# Altium project project.PrjPcb (part 1 of 2)
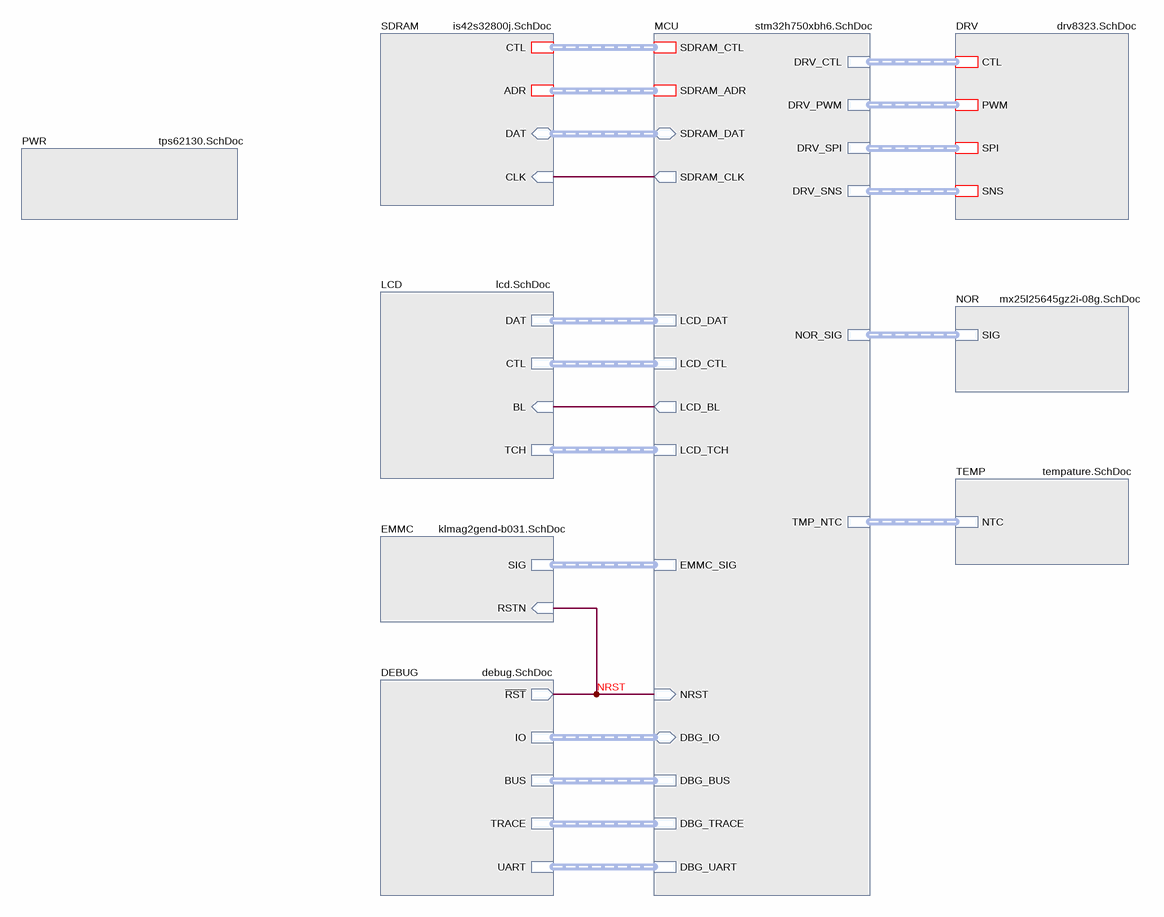
[diagram p0: top.SchDoc]
12 sheets, 396 parts. Net scope: hierarchical (ports join the sheet entries above them; power ports are global).
Board file: miaow_foc_board.PcbDoc
Sheets:
  top.SchDoc
    DRV = drv8323.SchDoc
    SDRAM = is42s32800j.SchDoc
    PWR = tps62130.SchDoc
    MCU = stm32h750xbh6.SchDoc
      MCU_PWR = stm32h750xbh6-pwr.SchDoc
      MCU_SIG = stm32h750xbh6-sig.SchDoc
    LCD = lcd.SchDoc
    EMMC = klmag2gend-b031.SchDoc
    NOR = mx25l25645gz2i-08g.SchDoc
    DEBUG = debug.SchDoc
    TEMP = tempature.SchDoc

## Sheet top.SchDoc: TOP
size A4; Date: 10.02.2025; CheckedBy: BCY; DrawnBy: miaow; DocumentNumber: 1; Revision: v0.0.1; SheetNumber: 1; SheetTotal: 12; Sample: A0; Url: github.com/miaow-cn/pcb-lib; Liscense: GPLv3; Board: MIAOW FOC BOARD; BoardType: MAIN_PCB; Desc: top overview

### Sub-sheets
DEBUG = debug.SchDoc: BUS (harness DBG_BUS), ~{RST} (out), TRACE (harness DBG_TRACE), UART (harness DBG_UART), IO (harness DBG_IO)
DRV = drv8323.SchDoc: CTL (harness DRV_CTL), SNS (harness DRV_SNS), SPI (harness DRV_SPI), PWM (harness DRV_PWM)
EMMC = klmag2gend-b031.SchDoc: SIG (harness EMMC_SIG), RSTN (in)
LCD = lcd.SchDoc: DAT (harness LCD_DAT), CTL (harness LCD_CTL), BL (in), TCH (harness LCD_TCH)
MCU = stm32h750xbh6.SchDoc: SDRAM_CLK (out), SDRAM_CTL (harness SDRAM_CTL), SDRAM_ADR (harness SDRAM_ADR), SDRAM_DAT (bidir, harness SDRAM_DAT), DRV_CTL (harness DRV_CTL), DRV_PWM (harness DRV_PWM), DRV_SPI (harness DRV_SPI), DRV_SNS (harness DRV_SNS), NRST (in), LCD_DAT (harness LCD_DAT), LCD_BL (out), LCD_TCH (harness LCD_TCH), EMMC_SIG (harness EMMC_SIG), NOR_SIG (harness NOR_SIG), LCD_CTL (harness LCD_CTL), DBG_TRACE (harness DBG_TRACE), DBG_UART (harness DBG_UART), DBG_BUS (harness DBG_BUS), DBG_IO (bidir, harness DBG_IO), TMP_NTC (harness TMP_NTC)
NOR = mx25l25645gz2i-08g.SchDoc: SIG (harness NOR_SIG)
PWR = tps62130.SchDoc: no entries
SDRAM = is42s32800j.SchDoc: ADR (harness SDRAM_ADR), CTL (harness SDRAM_CTL), CLK (in), DAT (bidir, harness SDRAM_DAT)
TEMP = tempature.SchDoc: NTC (harness TMP_NTC)

### Nets
BL: sheet MCU/LCD_BL, sheet LCD/BL
NRST: sheet MCU/NRST, sheet EMMC/RSTN, sheet DEBUG/~{RST}
SDRAM_CLK: sheet SDRAM/CLK, sheet MCU/SDRAM_CLK

### Buses and harness runs
harness sheet DEBUG/BUS = sheet MCU/DBG_BUS
harness sheet DEBUG/IO = sheet MCU/DBG_IO
harness sheet DEBUG/TRACE = sheet MCU/DBG_TRACE
harness sheet DEBUG/UART = sheet MCU/DBG_UART
harness sheet DRV/CTL = sheet MCU/DRV_CTL
harness sheet DRV/PWM = sheet MCU/DRV_PWM
harness sheet DRV/SNS = sheet MCU/DRV_SNS
harness sheet DRV/SPI = sheet MCU/DRV_SPI
harness sheet EMMC/SIG = sheet MCU/EMMC_SIG
harness sheet LCD/CTL = sheet MCU/LCD_CTL
harness sheet LCD/DAT = sheet MCU/LCD_DAT
harness sheet LCD/TCH = sheet MCU/LCD_TCH
harness sheet MCU/NOR_SIG = sheet NOR/SIG
harness sheet MCU/SDRAM_ADR = sheet SDRAM/ADR
harness sheet MCU/SDRAM_CTL = sheet SDRAM/CTL
harness sheet MCU/SDRAM_DAT = sheet SDRAM/DAT
harness sheet MCU/TMP_NTC = sheet TEMP/NTC

### Notes on the sheet
- DRAWN
- CHECKED
- DRAWNBY
- SHEETS
- SHEETS_NO

## Sheet drv8323.SchDoc: MDRV
size A4; Date: 02.10.2025; CheckedBy: BCY; DrawnBy: miaow; DocumentNumber: 3; Revision: v0.0.1; SheetNumber: 3; SheetTotal: 12; Sample: A0; Url: github.com/miaow-cn/pcb-lib; Liscense: GPLv3; Board: MIAOW FOC BOARD; BoardType: MAIN_PCB; Desc: 3-bridge motor driver
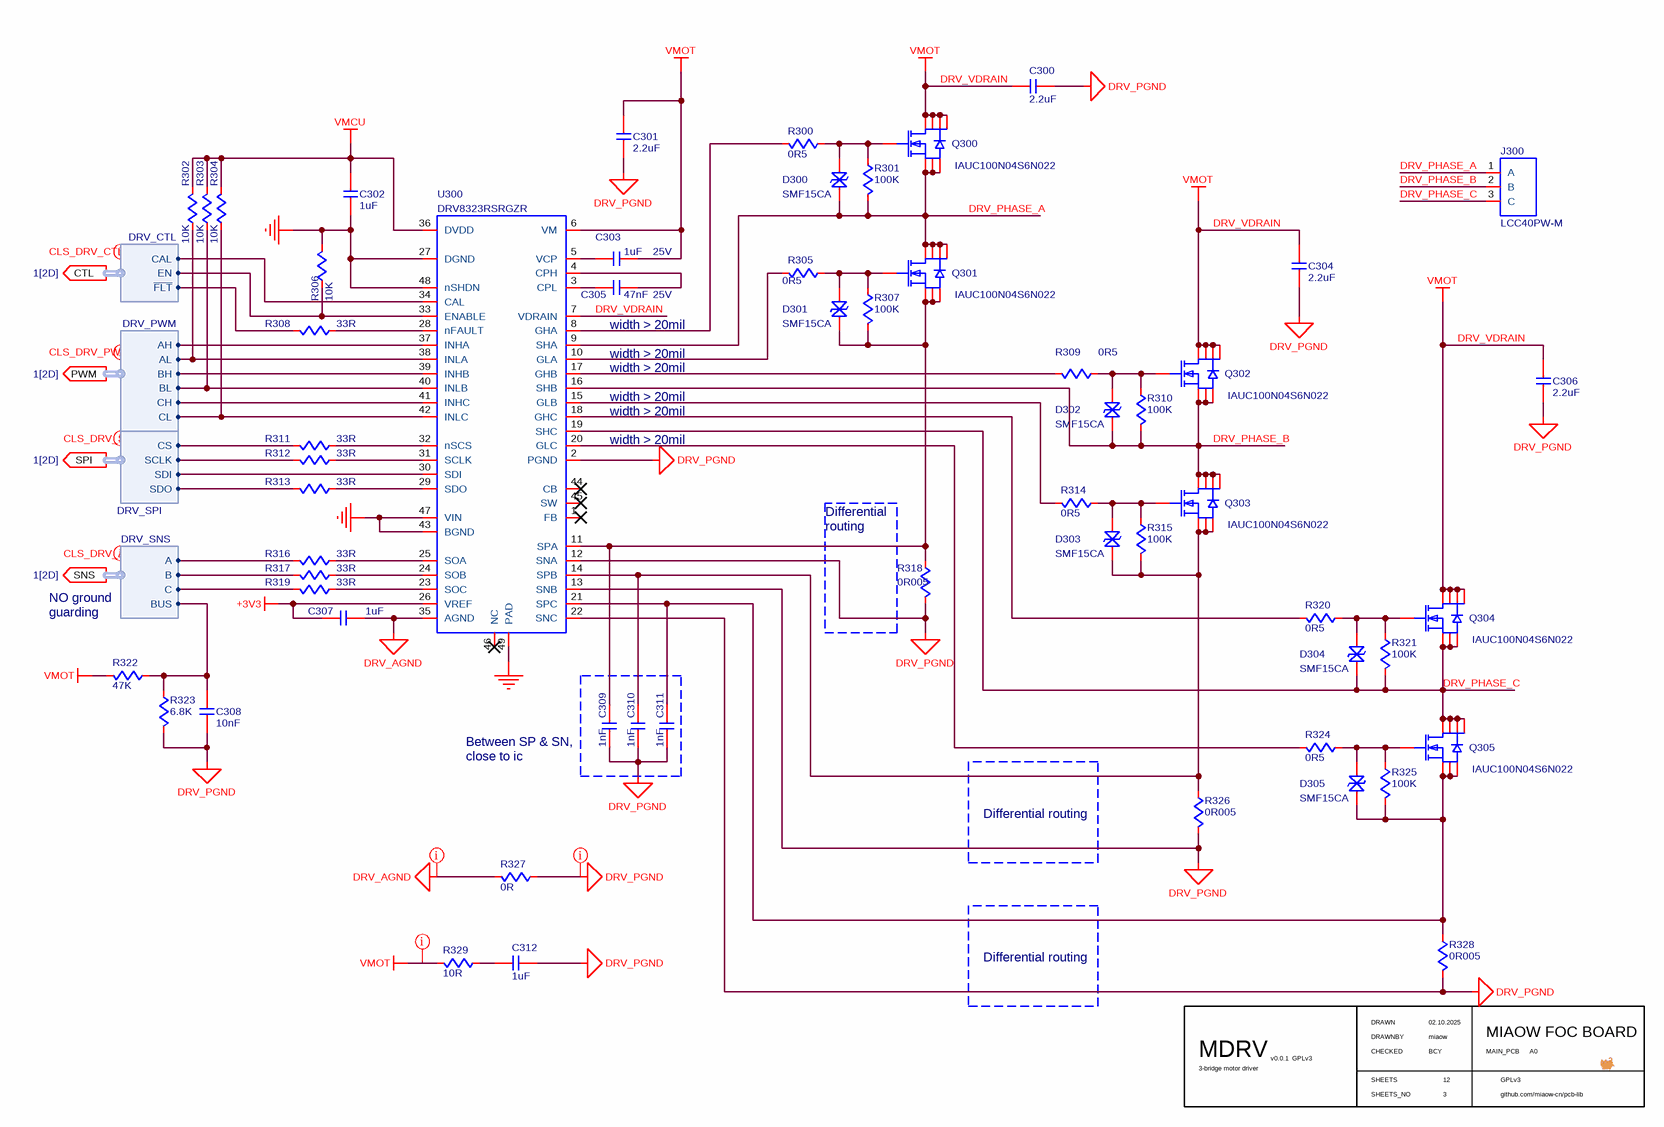
[diagram p1: drv8323.SchDoc]

### Parts
C300  value 2.2uF  [C0603]  (hidden comment: C-NOMO)
C301  value 2.2uF  [C0603]  (hidden comment: C-NOMO)
C302  value 1uF  [C0603]  (hidden comment: C-NOMO)
C303  value 1uF  voltage: 25V  [C0603]  (hidden comment: C-NOMO)
C304  value 2.2uF  [C0603]  (hidden comment: C-NOMO)
C305  value 47nF  voltage: 25V  [C0805]  (hidden comment: C-NOMO)
C306  value 2.2uF  [C0603]  (hidden comment: C-NOMO)
C307  value 1uF  [C0603]  (hidden comment: C-NOMO)
C308  value 10nF  [C0603]  (hidden comment: C-NOMO)
C309  value 1nF  [C0402]  (hidden comment: C-NOMO)
C310  value 1nF  [C0402]  (hidden comment: C-NOMO)
C311  value 1nF  [C0402]  (hidden comment: C-NOMO)
C312  value 1uF  [C0603]  (hidden comment: C-NOMO)
D300  SMF15CA  [SMF15CA]
D301  SMF15CA  [SMF15CA]
D302  SMF15CA  [SMF15CA]
D303  SMF15CA  [SMF15CA]
D304  SMF15CA  [SMF15CA]
D305  SMF15CA  [SMF15CA]
J300  LCC40PW-M  [LCC40PW-M]
Q300  IAUC100N04S6N022  [IAUC100N04S6N022]
Q301  IAUC100N04S6N022  [IAUC100N04S6N022]
Q302  IAUC100N04S6N022  [IAUC100N04S6N022]
Q303  IAUC100N04S6N022  [IAUC100N04S6N022]
Q304  IAUC100N04S6N022  [IAUC100N04S6N022]
Q305  IAUC100N04S6N022  [IAUC100N04S6N022]
R300  value 0R5  [R0805]  (hidden comment: R)
R301  value 100K  [R0603]  (hidden comment: R)
R302  value 10K  [R0402]  (hidden comment: R)
R303  value 10K  [R0402]  (hidden comment: R)
R304  value 10K  [R0402]  (hidden comment: R)
R305  value 0R5  [R0805]  (hidden comment: R)
R306  value 10K  [R0402]  (hidden comment: R)
R307  value 100K  [R0603]  (hidden comment: R)
R308  value 33R  [R0402]  (hidden comment: R)
R309  value 0R5  [R0805]  (hidden comment: R)
R310  value 100K  [R0603]  (hidden comment: R)
R311  value 33R  [R0402]  (hidden comment: R)
R312  value 33R  [R0402]  (hidden comment: R)
R313  value 33R  [R0402]  (hidden comment: R)
R314  value 0R5  [R0805]  (hidden comment: R)
R315  value 100K  [R0603]  (hidden comment: R)
R316  value 33R  [R0402]  (hidden comment: R)
R317  value 33R  [R0402]  (hidden comment: R)
R318  value 0R005  [R2512]  (hidden comment: R)
R319  value 33R  [R0402]  (hidden comment: R)
R320  value 0R5  [R0805]  (hidden comment: R)
R321  value 100K  [R0603]  (hidden comment: R)
R322  value 47K  [R0603]  (hidden comment: R)
R323  value 6.8K  [R0603]  (hidden comment: R)
R324  value 0R5  [R0805]  (hidden comment: R)
R325  value 100K  [R0603]  (hidden comment: R)
R326  value 0R005  [R2512]  (hidden comment: R)
R327  value 0R  [R0805]  (hidden comment: R)
R328  value 0R005  [R2512]  (hidden comment: R)
R329  value 10R  [R0603]  (hidden comment: R)
U300  DRV8323RSRGZR  [DRV8323RSRGZR]

### Ports
CTL (out, harness DRV_CTL, see 1[2D]), PWM (out, harness DRV_PWM, see 1[2D]), SNS (out, harness DRV_SNS, see 1[2D]), SPI (out, harness DRV_SPI, see 1[2D])

### Harnesses
DRV_CTL: CAL, EN, ~{FLT}
DRV_SNS: C, B, A, BUS
DRV_SPI: CS, SCLK, SDI, SDO
DRV_PWM: AH, AL, BH, BL, CH, CL

### Nets
+3V3: C302.2 C307.1 R302.1 R303.1 R304.1 U300.26(VREF) U300.36(DVDD)  [also labelled VMCU]
DRV_AGND: C307.2 R327.1 U300.35(AGND)
DRV_PGND: C300.1 C301.1 C304.1 C306.1 C308.2 C309.1 C310.1 C311.1 C312.1 R318.1 R323.1 R326.1 R327.2 R328.1 U300.2(PGND) U300.12(SNA) U300.13(SNB) U300.22(SNC)
DRV_VDRAIN: C300.2 C301.2 C303.2 C304.2 C306.2 Q300.5(D) Q300.6(D) Q300.7(D) Q300.8(D) Q302.5(D) Q302.6(D) Q302.7(D) Q302.8(D) Q304.5(D) Q304.6(D) Q304.7(D) Q304.8(D) R322.1 R329.1 U300.6(VM) U300.7(VDRAIN)  [also labelled VMOT]
GND: C302.1 R306.1 U300.27(DGND) U300.43(BGND) U300.47(VIN) U300.48(nSHDN) U300.49(PAD)  [project net GMCUA]
DRV_AH: U300.37(INHA) ; port PWM.AH
DRV_BH: U300.39(INHB) ; port PWM.BH
DRV_CAL: U300.34(CAL) ; port CTL.CAL
DRV_CH: U300.41(INHC) ; port PWM.CH
DRV_CS: R311.1 ; port SPI.CS
DRV_EN: R306.2 U300.33(ENABLE) ; port CTL.EN
DRV_FLT: R308.1 ; port CTL.~{FLT}
DRV_PHASE_A: D300.1 J300.1(A) Q300.1(S) Q300.2(S) Q300.3(S) Q301.5(D) Q301.6(D) Q301.7(D) Q301.8(D) R301.1 U300.9(SHA)
DRV_PHASE_B: D302.1 J300.2(B) Q302.1(S) Q302.2(S) Q302.3(S) Q303.5(D) Q303.6(D) Q303.7(D) Q303.8(D) R310.1 U300.16(SHB)
DRV_PHASE_C: D304.1 J300.3(C) Q304.1(S) Q304.2(S) Q304.3(S) Q305.5(D) Q305.6(D) Q305.7(D) Q305.8(D) R321.1 U300.19(SHC)
DRV_SCLK: R312.1 ; port SPI.SCLK
DRV_SDI: U300.30(SDI) ; port SPI.SDI
DRV_SDO: R313.1 ; port SPI.SDO
DRV_SNS_A: R316.1 ; port SNS.A
DRV_SNS_B: R317.1 ; port SNS.B
DRV_SNS_BUS: C308.1 R322.2 R323.2 ; port SNS.BUS
DRV_SNS_C: R319.1 ; port SNS.C
NetC303_1: C303.1 U300.5(VCP)
NetC305_1: C305.1 U300.3(CPL)
NetC305_2: C305.2 U300.4(CPH)
NetC309_2: C309.2 D301.1 Q301.1(S) Q301.2(S) Q301.3(S) R307.1 R318.2 U300.11(SPA)
NetC310_2: C310.2 D303.1 Q303.1(S) Q303.2(S) Q303.3(S) R315.1 R326.2 U300.14(SPB)
NetC311_2: C311.2 D305.1 Q305.1(S) Q305.2(S) Q305.3(S) R325.1 R328.2 U300.21(SPC)
NetC312_2: C312.2 R329.2
NetD300_2: D300.2 Q300.4(G) R300.2 R301.2
NetD301_2: D301.2 Q301.4(G) R305.2 R307.2
NetD302_2: D302.2 Q302.4(G) R309.2 R310.2
NetD303_2: D303.2 Q303.4(G) R314.2 R315.2
NetD304_2: D304.2 Q304.4(G) R320.2 R321.2
NetD305_2: D305.2 Q305.4(G) R324.2 R325.2
NetR300_1: R300.1 U300.8(GHA)
NetR302_2: R302.2 U300.38(INLA) ; port PWM.AL
NetR303_2: R303.2 U300.40(INLB) ; port PWM.BL
NetR304_2: R304.2 U300.42(INLC) ; port PWM.CL
NetR305_1: R305.1 U300.10(GLA)
NetR308_2: R308.2 U300.28(nFAULT)
NetR309_1: R309.1 U300.17(GHB)
NetR311_2: R311.2 U300.32(nSCS)
NetR312_2: R312.2 U300.31(SCLK)
NetR313_2: R313.2 U300.29(SDO)
NetR314_1: R314.1 U300.15(GLB)
NetR316_2: R316.2 U300.25(SOA)
NetR317_2: R317.2 U300.24(SOB)
NetR319_2: R319.2 U300.23(SOC)
NetR320_1: R320.1 U300.18(GHC)
NetR324_1: R324.1 U300.20(GLC)

Not connected (* = marked no-connect by the designer): U300 1(FB)* 44(CB)* 45(SW)* 46(NC)*

### Layout directives
net class CLS_PWR: DRV_AGND, DRV_PGND, DRV_VDRAIN
net class CLS_DRV_AN: (no net found under the mark)
net class CLS_DRV_SPI: (no net found under the mark)
net class CLS_DRV_PWM: (no net found under the mark)
net class CLS_DRV_CTL: (no net found under the mark)

### Notes on the sheet
- width > 20mil
- (near U300) width > 20mil
- (near R318) Differential routing
- (near R322) NO ground guarding
- (near C309) Between SP & SN, close to ic
- Differential routing
- DRAWN
- CHECKED
- DRAWNBY
- SHEETS
- SHEETS_NO

### Library data of the parts
C300-C302 C304 C306-C312 = C-NOMO: voltage: 25V; precision: 5%
C303 C305 = C-NOMO: precision: 5%
D300-D305 = SMF15CA: TVS/ESD; Supplier 1: LCSC; Supplier Part Number 1: C123803
J300 = LCC40PW-M: CONNECTOR - 3pin, power; Supplier 1: LCSC; Supplier Part Number 1: C7437310
R300-R329 = R: precision: 1%
Q300-Q305 = IAUC100N04S6N022: Supplier 1: LCSC; Supplier Part Number 1: C535695
U300 = DRV8323RSRGZR: Supplier 1: LCSC; Supplier Part Number 1: C545497

## Sheet is42s32800j.SchDoc: RAM
size A4; Date: 10.02.2025; CheckedBy: BCY; DrawnBy: miaow; DocumentNumber: 4; Revision: v0.0.1; SheetNumber: 4; SheetTotal: 12; Sample: A0; Url: github.com/miaow-cn/pcb-lib; Liscense: GPLv3; Board: MIAOW FOC BOARD; BoardType: MAIN_PCB; Desc: sdram of 32-bit data size
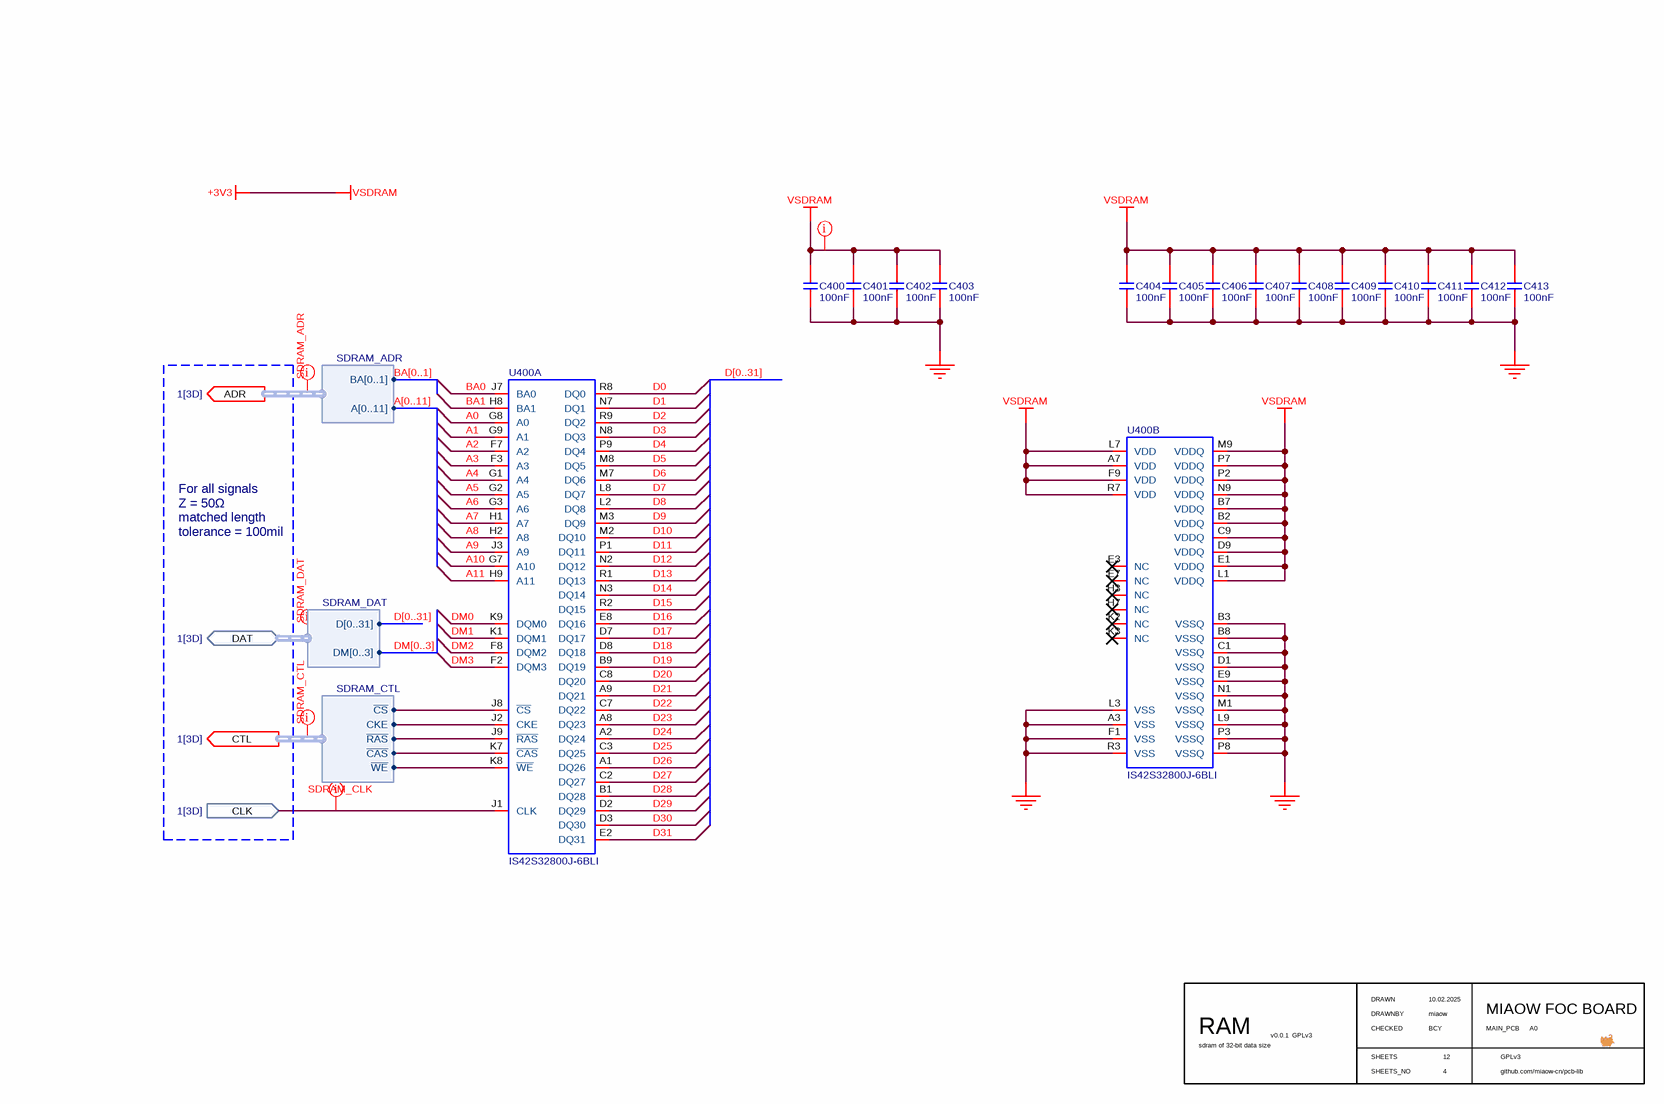
[diagram p2: is42s32800j.SchDoc]

### Parts
C400  value 100nF  [C0402]  (hidden comment: C-NOMO)
C401  value 100nF  [C0402]  (hidden comment: C-NOMO)
C402  value 100nF  [C0402]  (hidden comment: C-NOMO)
C403  value 100nF  [C0402]  (hidden comment: C-NOMO)
C404  value 100nF  [C0402]  (hidden comment: C-NOMO)
C405  value 100nF  [C0402]  (hidden comment: C-NOMO)
C406  value 100nF  [C0402]  (hidden comment: C-NOMO)
C407  value 100nF  [C0402]  (hidden comment: C-NOMO)
C408  value 100nF  [C0402]  (hidden comment: C-NOMO)
C409  value 100nF  [C0402]  (hidden comment: C-NOMO)
C410  value 100nF  [C0402]  (hidden comment: C-NOMO)
C411  value 100nF  [C0402]  (hidden comment: C-NOMO)
C412  value 100nF  [C0402]  (hidden comment: C-NOMO)
C413  value 100nF  [C0402]  (hidden comment: C-NOMO)
U400  IS42S32800J-6BLI  [IS42S32800J-6BLI]  (parts A,B of 2)

### Ports
ADR (out, harness SDRAM_ADR, see 1[3D]), CLK (in, see 1[3D]), CTL (out, harness SDRAM_CTL, see 1[3D]), DAT (bidir, harness SDRAM_DAT, see 1[3D])

### Harnesses
SDRAM_CTL: ~{CS}, CKE, ~{RAS}, ~{CAS}, ~{WE}
SDRAM_ADR: BA[0..1], A[0..11]
SDRAM_DAT: DM[0..3], D[0..31]

### Nets
+3V3: C400.2 C401.2 C402.2 C403.2 C404.2 C405.2 C406.2 C407.2 C408.2 C409.2 C410.2 C411.2 C412.2 C413.2 U400.A7(VDD) U400.B2(VDDQ) U400.B7(VDDQ) U400.C9(VDDQ) U400.D9(VDDQ) U400.E1(VDDQ) U400.F9(VDD) U400.L1(VDDQ) U400.L7(VDD) U400.M9(VDDQ) U400.N9(VDDQ) U400.P2(VDDQ) U400.P7(VDDQ) U400.R7(VDD)  [also labelled VSDRAM]
GND: C400.1 C401.1 C402.1 C403.1 C404.1 C405.1 C406.1 C407.1 C408.1 C409.1 C410.1 C411.1 C412.1 C413.1 U400.A3(VSS) U400.B3(VSSQ) U400.B8(VSSQ) U400.C1(VSSQ) U400.D1(VSSQ) U400.E9(VSSQ) U400.F1(VSS) U400.L3(VSS) U400.L9(VSSQ) U400.M1(VSSQ) U400.N1(VSSQ) U400.P3(VSSQ) U400.P8(VSSQ) U400.R3(VSS)  [project net GMCUA]
A0: U400.G8(A0)
A1: U400.G9(A1)
A2: U400.F7(A2)
A3: U400.F3(A3)
A4: U400.G1(A4)
A5: U400.G2(A5)
A6: U400.G3(A6)
A7: U400.H1(A7)
A8: U400.H2(A8)
A9: U400.J3(A9)
A10: U400.G7(A10)
A11: U400.H9(A11)
BA0: U400.J7(BA0)
BA1: U400.H8(BA1)
D0: U400.R8(DQ0)
D1: U400.N7(DQ1)
D2: U400.R9(DQ2)
D3: U400.N8(DQ3)
D4: U400.P9(DQ4)
D5: U400.M8(DQ5)
D6: U400.M7(DQ6)
D7: U400.L8(DQ7)
D8: U400.L2(DQ8)
D9: U400.M3(DQ9)
D10: U400.M2(DQ10)
D11: U400.P1(DQ11)
D12: U400.N2(DQ12)
D13: U400.R1(DQ13)
D14: U400.N3(DQ14)
D15: U400.R2(DQ15)
D16: U400.E8(DQ16)
D17: U400.D7(DQ17)
D18: U400.D8(DQ18)
D19: U400.B9(DQ19)
D20: U400.C8(DQ20)
D21: U400.A9(DQ21)
D22: U400.C7(DQ22)
D23: U400.A8(DQ23)
D24: U400.A2(DQ24)
D25: U400.C3(DQ25)
D26: U400.A1(DQ26)
D27: U400.C2(DQ27)
D28: U400.B1(DQ28)
D29: U400.D2(DQ29)
D30: U400.D3(DQ30)
D31: U400.E2(DQ31)
DM0: U400.K9(DQM0)
DM1: U400.K1(DQM1)
DM2: U400.F8(DQM2)
DM3: U400.F2(DQM3)
SDRAM_CAS: U400.K7(~{CAS}) ; port CTL.~{CAS}
SDRAM_CKE: U400.J2(CKE) ; port CTL.CKE
SDRAM_CLK: U400.J1(CLK) ; port CLK
SDRAM_CS: U400.J8(~{CS}) ; port CTL.~{CS}
SDRAM_RAS: U400.J9(~{RAS}) ; port CTL.~{RAS}
SDRAM_WE: U400.K8(~{WE}) ; port CTL.~{WE}

Not connected (* = marked no-connect by the designer): U400 E3(NC)* E7(NC)* H3(NC)* H7(NC)* K2(NC)* K3(NC)*

### Buses and harness runs
bus A[0..11]
bus BA[0..1]
bus D[0..31]
bus DM[0..3]

### Layout directives
net class SDRAM_CTL: (no net found under the mark)
net class SDRAM_ADR: (no net found under the mark)
net class SDRAM_CLK: SDRAM_CLK
net class SDRAM_DAT: (no net found under the mark)
net class CLS_PWR: +3V3

### Notes on the sheet
- For all signals
  Z = 50Ω
  matched length tolerance = 100mil
- DRAWN
- CHECKED
- DRAWNBY
- SHEETS
- SHEETS_NO

### Library data of the parts
C400-C413 = C-NOMO: voltage: 25V; precision: 5%
U400 = IS42S32800J-6BLI: Supplier 1: LCSC; Supplier Part Number 1: C1351419; ClassName: BGA

## Sheet tps62130.SchDoc: PWR
size A4; Date: 02.10.2025; CheckedBy: BCY; DrawnBy: miaow; DocumentNumber: 2; Revision: v0.0.1; SheetNumber: 2; SheetTotal: 12; Sample: A0; Url: github.com/miaow-cn/pcb-lib; Liscense: GPLv3; Board: MAIOW FOC BOARD; BoardType: MAIN_PCB; Desc: dc-dc syncronize buck converter
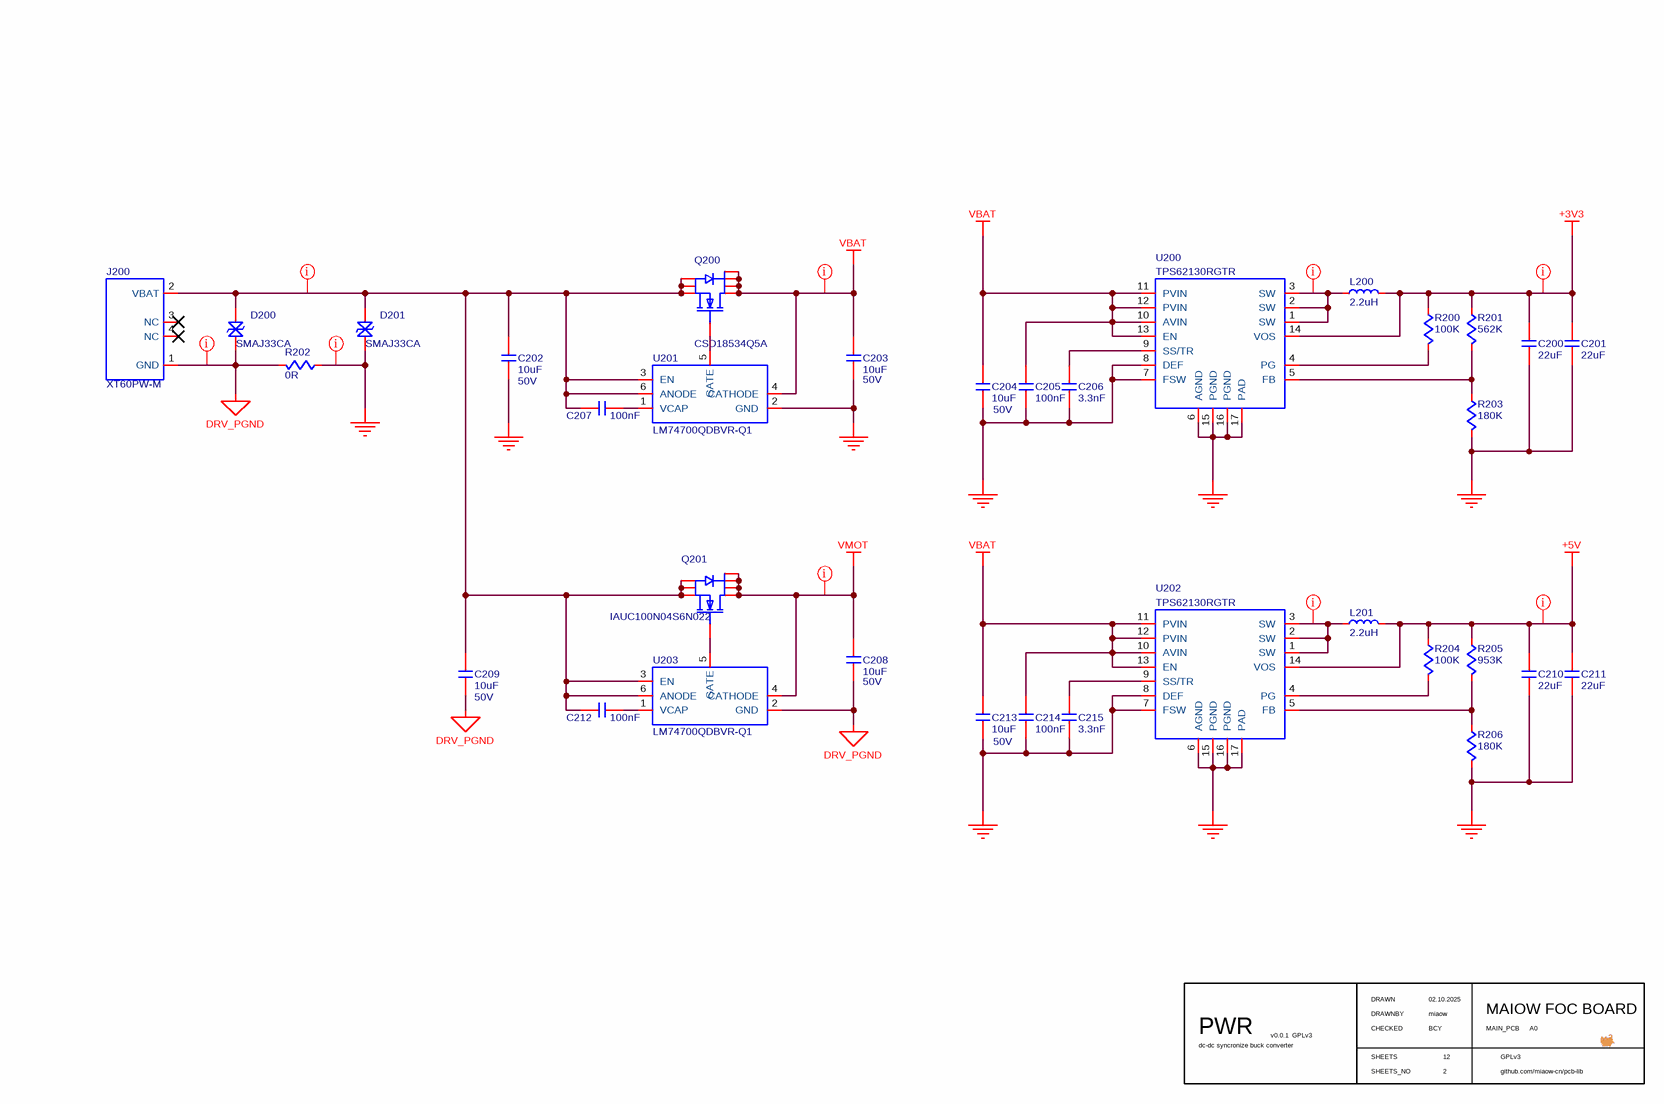
[diagram p3: tps62130.SchDoc]

### Parts
C200  value 22uF  [C0805]  (hidden comment: C-NOMO)
C201  value 22uF  [C0805]  (hidden comment: C-NOMO)
C202  value 10uF  voltage: 50V  [C0805]  (hidden comment: C-NOMO)
C203  value 10uF  voltage: 50V  [C0805]  (hidden comment: C-NOMO)
C204  value 10uF  voltage: 50V  [C0805]  (hidden comment: C-NOMO)
C205  value 100nF  [C0603]  (hidden comment: C-NOMO)
C206  value 3.3nF  [C0402]  (hidden comment: C-NOMO)
C207  value 100nF  [C0402]  (hidden comment: C-NOMO)
C208  value 10uF  voltage: 50V  [C0805]  (hidden comment: C-NOMO)
C209  value 10uF  voltage: 50V  [C0805]  (hidden comment: C-NOMO)
C210  value 22uF  [C0805]  (hidden comment: C-NOMO)
C211  value 22uF  [C0805]  (hidden comment: C-NOMO)
C212  value 100nF  [C0402]  (hidden comment: C-NOMO)
C213  value 10uF  voltage: 50V  [C0805]  (hidden comment: C-NOMO)
C214  value 100nF  [C0603]  (hidden comment: C-NOMO)
C215  value 3.3nF  [C0402]  (hidden comment: C-NOMO)
D200  SMAJ33CA  [SMAJ33CA]
D201  SMAJ33CA  [SMAJ33CA]
J200  XT60PW-M  [XT60PW-M]
L200  value 2.2uH  [FXL0420]  (hidden comment: L)
L201  value 2.2uH  [FXL0420]  (hidden comment: L)
Q200  CSD18534Q5A  [CSD18534Q5A]
Q201  IAUC100N04S6N022  [IAUC100N04S6N022]
R200  value 100K  [R0402]  (hidden comment: R)
R201  value 562K  [R0603]  (hidden comment: R)
R202  value 0R  [R1206]  (hidden comment: R)
R203  value 180K  [R0603]  (hidden comment: R)
R204  value 100K  [R0402]  (hidden comment: R)
R205  value 953K  [R0603]  (hidden comment: R)
R206  value 180K  [R0603]  (hidden comment: R)
U200  TPS62130RGTR  [TPS62130RGTR]
U201  LM74700QDBVR-Q1  [LM74700QDBVR-Q1]
U202  TPS62130RGTR  [TPS62130RGTR]
U203  LM74700QDBVR-Q1  [LM74700QDBVR-Q1]

### Nets
+3V3: C200.2 C201.2 L200.2 R200.2 R201.2 U200.14(VOS)
+5V: C210.2 C211.2 L201.2 R204.2 R205.2 U202.14(VOS)
DRV_PGND: C208.1 C209.1 D200.1 J200.1(GND) R202.1 U203.2(GND)
GND: C200.1 C201.1 C202.1 C203.1 C204.1 C205.1 C206.1 C210.1 C211.1 C213.1 C214.1 C215.1 D201.1 R202.2 R203.1 R206.1 U200.6(AGND) U200.7(FSW) U200.8(DEF) U200.15(PGND) U200.16(PGND) U200.17(PAD) U201.2(GND) U202.6(AGND) U202.7(FSW) U202.8(DEF) U202.15(PGND) U202.16(PGND) U202.17(PAD)  [project net GMCUA]
VBAT: C203.2 C204.2 C205.2 C213.2 C214.2 Q200.5(D) Q200.6(D) Q200.7(D) Q200.8(D) U200.10(AVIN) U200.11(PVIN) U200.12(PVIN) U200.13(EN) U201.4(CATHODE) U202.10(AVIN) U202.11(PVIN) U202.12(PVIN) U202.13(EN)
VMOT: C208.2 Q201.5(D) Q201.6(D) Q201.7(D) Q201.8(D) U203.4(CATHODE)  [project net DRV_VDRAIN]
NetC202_2: C202.2 C207.1 C209.2 C212.1 D200.2 D201.2 J200.2(VBAT) Q200.1(S) Q200.2(S) Q200.3(S) Q201.1(S) Q201.2(S) Q201.3(S) U201.3(EN) U201.6(ANODE) U203.3(EN) U203.6(ANODE)
NetC206_2: C206.2 U200.9(SS/TR)
NetC207_2: C207.2 U201.1(VCAP)
NetC212_2: C212.2 U203.1(VCAP)
NetC215_2: C215.2 U202.9(SS/TR)
NetL200_1: L200.1 U200.1(SW) U200.2(SW) U200.3(SW)
NetL201_1: L201.1 U202.1(SW) U202.2(SW) U202.3(SW)
NetQ200_4: Q200.4(G) U201.5(GATE)
NetQ201_4: Q201.4(G) U203.5(GATE)
NetR200_1: R200.1 U200.4(PG)
NetR201_1: R201.1 R203.2 U200.5(FB)
NetR204_1: R204.1 U202.4(PG)
NetR205_1: R205.1 R206.2 U202.5(FB)

Not connected (* = marked no-connect by the designer): J200 3(NC)* 4(NC)*

### Layout directives
net class CLS_PWR: +3V3, +5V, DRV_PGND, DRV_VDRAIN, GMCUA, NetC202_2, NetL200_1, NetL201_1, VBAT

### Notes on the sheet
- DRAWN
- CHECKED
- DRAWNBY
- SHEETS
- SHEETS_NO

### Library data of the parts
C200 C201 C205-C207 C210-C212 C214 C215 = C-NOMO: voltage: 25V; precision: 5%
C202-C204 C208 C209 C213 = C-NOMO: precision: 5%
D200 D201 = SMAJ33CA: TVS/ESD; Supplier 1: LCSC; Supplier Part Number 1: C316048
J200 = XT60PW-M: CONNECTOR - dc supply; Supplier 1: LCSC; Supplier Part Number 1: C98732
L200 L201 = L: Code_IEC: 1005; Published: 8-Jun-2000; LatestRevisionDate: 29-May-2009; LatestRevisionNote: IPC-7351 Footprint Added.; PackageReference: 0402-A; Publisher: Altium Limited; PackageDescription: Chip Inductor; Code_JEITA: 0402
Q200 = CSD18534Q5A: NMOS; Supplier 1: LCSC; Supplier Part Number 1: C115943
Q201 = IAUC100N04S6N022: NMOS; Supplier 1: LCSC; Supplier Part Number 1: C535695
R200-R206 = R: precision: 1%
U201 U203 = LM74700QDBVR-Q1: IDEAL DIODE; Supplier Part Number 1: C2941042; Supplier 1: LCSC
U200 U202 = TPS62130RGTR: Supplier 1: LCSC; Supplier Part Number 1: C43590

## Sheet stm32h750xbh6.SchDoc: MCU
size A4; Date: 10.04.2025; CheckedBy: BCY; DrawnBy: miaow; DocumentNumber: 5; Revision: v0.0.1; SheetNumber: 5; SheetTotal: 12; Sample: A0; Url: github.com/miaow-cn/pcb-lib; Liscense: GPLv3; Board: MIAOW FOC BOARD; BoardType: MAIN_PCB; Desc: stm32h750xbh6
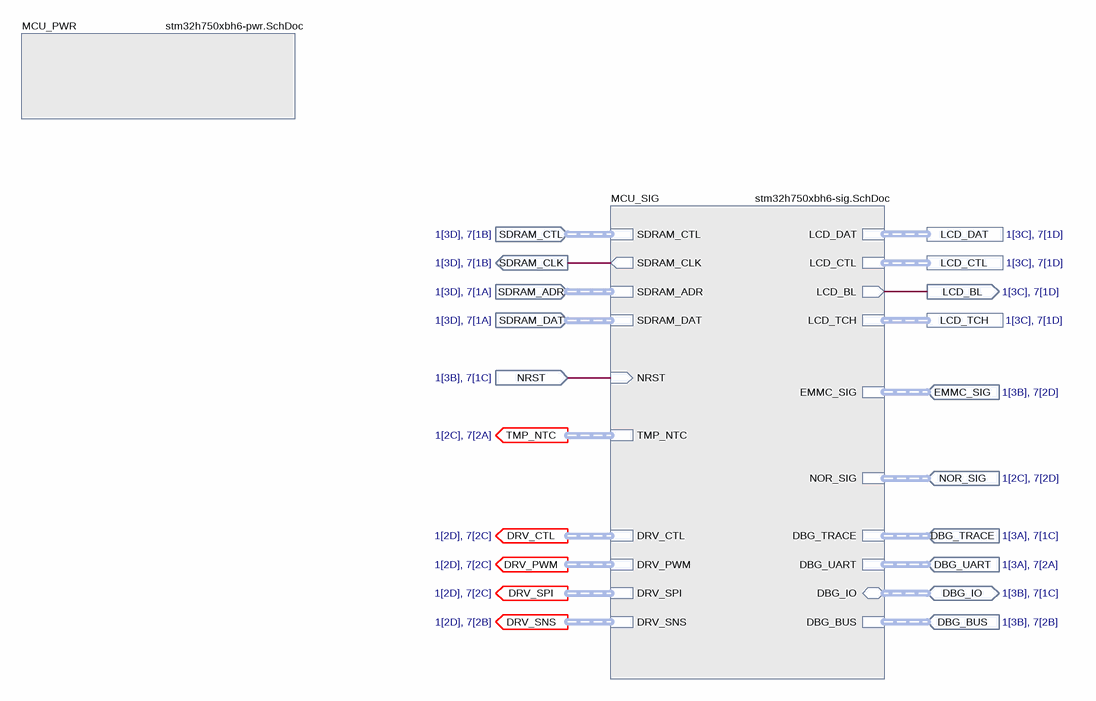
[diagram p4: stm32h750xbh6.SchDoc]

### Sub-sheets
MCU_PWR = stm32h750xbh6-pwr.SchDoc: no entries
MCU_SIG = stm32h750xbh6-sig.SchDoc: SDRAM_CTL (harness SDRAM_CTL), SDRAM_CLK (out), SDRAM_DAT (harness SDRAM_DAT), SDRAM_ADR (harness SDRAM_ADR), NRST (in), DRV_CTL (harness DRV_CTL), DRV_PWM (harness DRV_PWM), DRV_SPI (harness DRV_SPI), DRV_SNS (harness DRV_SNS), LCD_DAT (harness LCD_DAT), LCD_CTL (harness LCD_CTL), LCD_BL (out), LCD_TCH (harness LCD_TCH), EMMC_SIG (harness EMMC_SIG), NOR_SIG (harness NOR_SIG), DBG_TRACE (harness DBG_TRACE), DBG_UART (harness DBG_UART), DBG_IO (bidir, harness DBG_IO), DBG_BUS (harness DBG_BUS), TMP_NTC (harness TMP_NTC)

### Ports
DBG_BUS (in, harness DBG_BUS, see 1[3B], 7[2B]), DBG_IO (bidir, harness DBG_IO, see 1[3B], 7[1C]), DBG_TRACE (in, harness DBG_TRACE, see 1[3A], 7[1C]), DBG_UART (in, harness DBG_UART, see 1[3A], 7[2A]), DRV_CTL (out, harness DRV_CTL, see 1[2D], 7[2C]), DRV_PWM (out, harness DRV_PWM, see 1[2D], 7[2C]), DRV_SNS (out, harness DRV_SNS, see 1[2D], 7[2B]), DRV_SPI (out, harness DRV_SPI, see 1[2D], 7[2C]), EMMC_SIG (in, harness EMMC_SIG, see 1[3B], 7[2D]), LCD_BL (out, see 1[3C], 7[1D]), LCD_CTL (harness LCD_CTL, see 1[3C], 7[1D]), LCD_DAT (harness LCD_DAT, see 1[3C], 7[1D]), LCD_TCH (harness LCD_TCH, see 1[3C], 7[1D]), NOR_SIG (in, harness NOR_SIG, see 1[2C], 7[2D]), NRST (in, see 1[3B], 7[1C]), SDRAM_ADR (in, harness SDRAM_ADR, see 1[3D], 7[1A]), SDRAM_CLK (out, see 1[3D], 7[1B]), SDRAM_CTL (in, harness SDRAM_CTL, see 1[3D], 7[1B]), SDRAM_DAT (in, harness SDRAM_DAT, see 1[3D], 7[1A]), TMP_NTC (out, harness TMP_NTC, see 1[2C], 7[2A])

### Nets
BL: port LCD_BL, sheet MCU_SIG/LCD_BL
NRST: port NRST, sheet MCU_SIG/NRST
SDRAM_CLK: port SDRAM_CLK, sheet MCU_SIG/SDRAM_CLK

### Buses and harness runs
harness port DBG_BUS = sheet MCU_SIG/DBG_BUS
harness port DBG_IO = sheet MCU_SIG/DBG_IO
harness port DBG_TRACE = sheet MCU_SIG/DBG_TRACE
harness port DBG_UART = sheet MCU_SIG/DBG_UART
harness port DRV_CTL = sheet MCU_SIG/DRV_CTL
harness port DRV_PWM = sheet MCU_SIG/DRV_PWM
harness port DRV_SNS = sheet MCU_SIG/DRV_SNS
harness port DRV_SPI = sheet MCU_SIG/DRV_SPI
harness port EMMC_SIG = sheet MCU_SIG/EMMC_SIG
harness port LCD_CTL = sheet MCU_SIG/LCD_CTL
harness port LCD_DAT = sheet MCU_SIG/LCD_DAT
harness port LCD_TCH = sheet MCU_SIG/LCD_TCH
harness port NOR_SIG = sheet MCU_SIG/NOR_SIG
harness port SDRAM_ADR = sheet MCU_SIG/SDRAM_ADR
harness port SDRAM_CTL = sheet MCU_SIG/SDRAM_CTL
harness port SDRAM_DAT = sheet MCU_SIG/SDRAM_DAT
harness port TMP_NTC = sheet MCU_SIG/TMP_NTC

### Notes on the sheet
- DRAWN
- CHECKED
- DRAWNBY
- SHEETS
- SHEETS_NO

## Sheet stm32h750xbh6-pwr.SchDoc: MCUA
size A4; Date: 10.04.2025; CheckedBy: BCY; DrawnBy: miaow; DocumentNumber: 6; Revision: v0.0.1; SheetNumber: 6; SheetTotal: 12; Sample: A0; Url: github.com/miaow-cn/pcb-lib; Liscense: GPLv3; Board: MIAOW FOC BOARD; BoardType: MAIN_PCB; Desc: power part of stm32h750xbh6
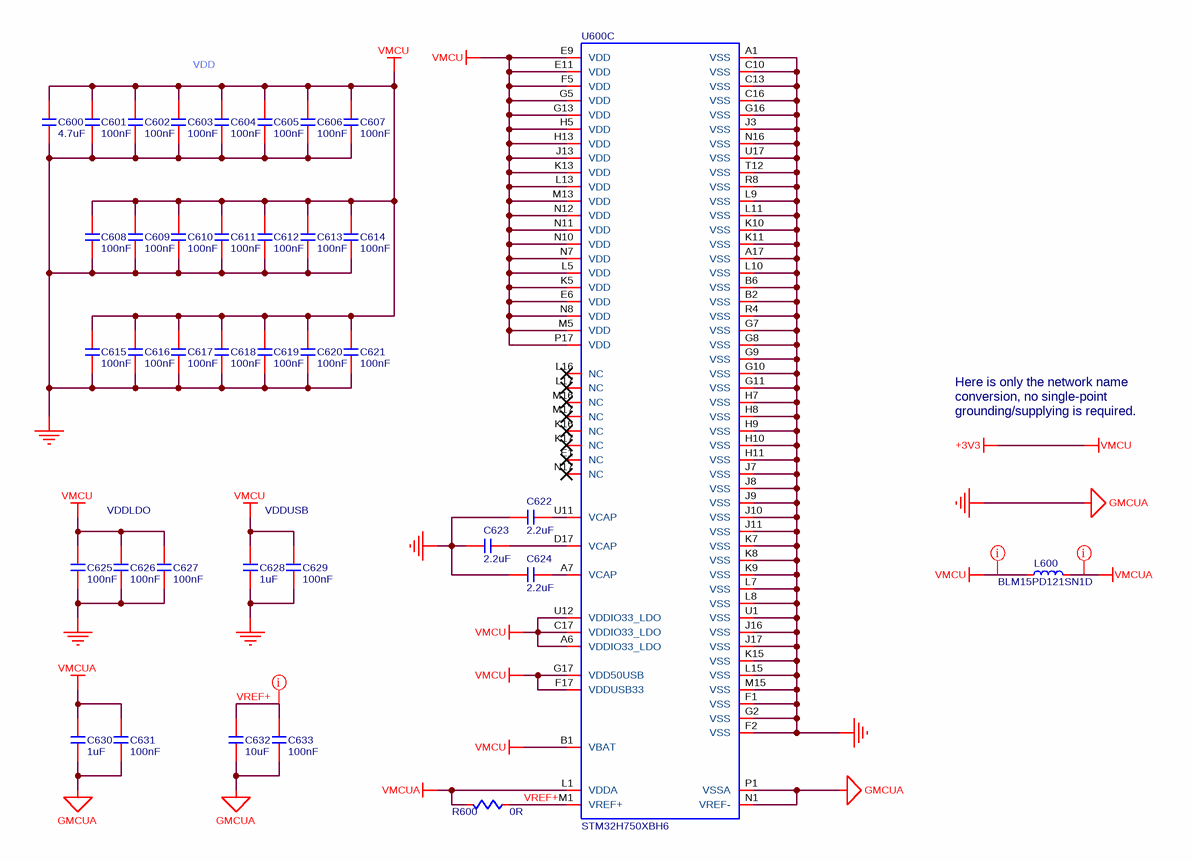
[diagram p5: stm32h750xbh6-pwr.SchDoc]

### Parts
C600  value 4.7uF  [C0603]  (hidden comment: C-NOMO)
C601  value 100nF  [C0402]  (hidden comment: C-NOMO)
C602  value 100nF  [C0402]  (hidden comment: C-NOMO)
C603  value 100nF  [C0402]  (hidden comment: C-NOMO)
C604  value 100nF  [C0402]  (hidden comment: C-NOMO)
C605  value 100nF  [C0402]  (hidden comment: C-NOMO)
C606  value 100nF  [C0402]  (hidden comment: C-NOMO)
C607  value 100nF  [C0402]  (hidden comment: C-NOMO)
C608  value 100nF  [C0402]  (hidden comment: C-NOMO)
C609  value 100nF  [C0402]  (hidden comment: C-NOMO)
C610  value 100nF  [C0402]  (hidden comment: C-NOMO)
C611  value 100nF  [C0402]  (hidden comment: C-NOMO)
C612  value 100nF  [C0402]  (hidden comment: C-NOMO)
C613  value 100nF  [C0402]  (hidden comment: C-NOMO)
C614  value 100nF  [C0402]  (hidden comment: C-NOMO)
C615  value 100nF  [C0402]  (hidden comment: C-NOMO)
C616  value 100nF  [C0402]  (hidden comment: C-NOMO)
C617  value 100nF  [C0402]  (hidden comment: C-NOMO)
C618  value 100nF  [C0402]  (hidden comment: C-NOMO)
C619  value 100nF  [C0402]  (hidden comment: C-NOMO)
C620  value 100nF  [C0402]  (hidden comment: C-NOMO)
C621  value 100nF  [C0402]  (hidden comment: C-NOMO)
C622  value 2.2uF  [C0603]  (hidden comment: C-NOMO)
C623  value 2.2uF  [C0603]  (hidden comment: C-NOMO)
C624  value 2.2uF  [C0603]  (hidden comment: C-NOMO)
C625  value 100nF  [C0402]  (hidden comment: C-NOMO)
C626  value 100nF  [C0402]  (hidden comment: C-NOMO)
C627  value 100nF  [C0402]  (hidden comment: C-NOMO)
C628  value 1uF  [C0603]  (hidden comment: C-NOMO)
C629  value 100nF  [C0402]  (hidden comment: C-NOMO)
C630  value 1uF  [C0603]  (hidden comment: C-NOMO)
C631  value 100nF  [C0402]  (hidden comment: C-NOMO)
C632  value 10uF  [C0805]  (hidden comment: C-NOMO)
C633  value 100nF  [C0402]  (hidden comment: C-NOMO)
L600  BLM15PD121SN1D  [L0402]
R600  value 0R  [R0603]  (hidden comment: R)
U600  STM32H750XBH6  [STM32H750XBH6]  (part C of 3)

### Nets
+3V3: C600.2 C601.2 C602.2 C603.2 C604.2 C605.2 C606.2 C607.2 C608.2 C609.2 C610.2 C611.2 C612.2 C613.2 C614.2 C615.2 C616.2 C617.2 C618.2 C619.2 C620.2 C621.2 C625.2 C626.2 C627.2 C628.2 C629.2 L600.1 U600.A6(VDDIO33_LDO) U600.B1(VBAT) U600.C17(VDDIO33_LDO) U600.E6(VDD) U600.E9(VDD) U600.E11(VDD) U600.F5(VDD) U600.F17(VDDUSB33) U600.G5(VDD) U600.G13(VDD) U600.G17(VDD50USB) U600.H5(VDD) U600.H13(VDD) U600.J13(VDD) U600.K5(VDD) U600.K13(VDD) U600.L5(VDD) U600.L13(VDD) U600.M5(VDD) U600.M13(VDD) U600.N7(VDD) U600.N8(VDD) U600.N10(VDD) U600.N11(VDD) U600.N12(VDD) U600.P17(VDD) U600.U12(VDDIO33_LDO)  [also labelled VMCU]
GMCUA: C600.1 C601.1 C602.1 C603.1 C604.1 C605.1 C606.1 C607.1 C608.1 C609.1 C610.1 C611.1 C612.1 C613.1 C614.1 C615.1 C616.1 C617.1 C618.1 C619.1 C620.1 C621.1 C622.1 C623.1 C624.1 C625.1 C626.1 C627.1 C628.1 C629.1 C630.1 C631.1 C632.1 C633.1 U600.A1(VSS) U600.A17(VSS) U600.B2(VSS) U600.B6(VSS) U600.C10(VSS) U600.C13(VSS) U600.C16(VSS) U600.F1(VSS) U600.F2(VSS) U600.G2(VSS) U600.G7(VSS) U600.G8(VSS) U600.G9(VSS) U600.G10(VSS) U600.G11(VSS) U600.G16(VSS) U600.H7(VSS) U600.H8(VSS) U600.H9(VSS) U600.H10(VSS) U600.H11(VSS) U600.J3(VSS) U600.J7(VSS) U600.J8(VSS) U600.J9(VSS) U600.J10(VSS) U600.J11(VSS) U600.J16(VSS) U600.J17(VSS) U600.K7(VSS) U600.K8(VSS) U600.K9(VSS) U600.K10(VSS) U600.K11(VSS) U600.K15(VSS) U600.L7(VSS) U600.L8(VSS) U600.L9(VSS) U600.L10(VSS) U600.L11(VSS) U600.L15(VSS) U600.M15(VSS) U600.N1(VREF-) U600.N16(VSS) U600.P1(VSSA) U600.R4(VSS) U600.R8(VSS) U600.T12(VSS) U600.U1(VSS) U600.U17(VSS)  [also labelled GND]
VMCUA: C630.2 C631.2 L600.2 R600.1 U600.L1(VDDA)
VREF+: C632.2 C633.2 R600.2 U600.M1(VREF+)
NetC622_2: C622.2 U600.U11(VCAP)
NetC623_2: C623.2 U600.D17(VCAP)
NetC624_2: C624.2 U600.A7(VCAP)

Not connected (* = marked no-connect by the designer): U600 E1(NC)* K16(NC)* K17(NC)* L16(NC)* L17(NC)* M16(NC)* M17(NC)* N17(NC)*

### Layout directives
net class CLS_PWR: +3V3, VMCUA, VREF+

### Notes on the sheet
- VDD
- Here is only the network name conversion, no single-point grounding/supplying is required.
- VDDLDO
- VDDUSB
- DRAWN
- CHECKED
- DRAWNBY
- SHEETS
- SHEETS_NO

### Library data of the parts
C600-C633 = C-NOMO: voltage: 25V; precision: 5%
L600 = L: Code_IEC: 1005; Value: 120R@100MHz; Published: 8-Jun-2000; LatestRevisionDate: 29-May-2009; LatestRevisionNote: IPC-7351 Footprint Added.; PackageReference: 0402-A; Publisher: Altium Limited; PackageDescription: Chip Inductor; Code_JEITA: 0402
R600 = R: precision: 1%
U600 = STM32H750XBH6: MCU; Supplier 1: LCSC; Supplier Part Number 1: C405932

## Sheet stm32h750xbh6-sig.SchDoc: MCUB
size A4; Date: 10.4.2025; CheckedBy: BCY; DrawnBy: miaow; DocumentNumber: 7; Revision: v0.0.1; SheetNumber: 7; SheetTotal: 12; Sample: A0; Url: github.com/miaow-cn/pcb-lib; Liscense: GPLv3; Board: MIAOW FOC BOARD; BoardType: MAIN_PCB; Desc: io part of stm32h750xbh6
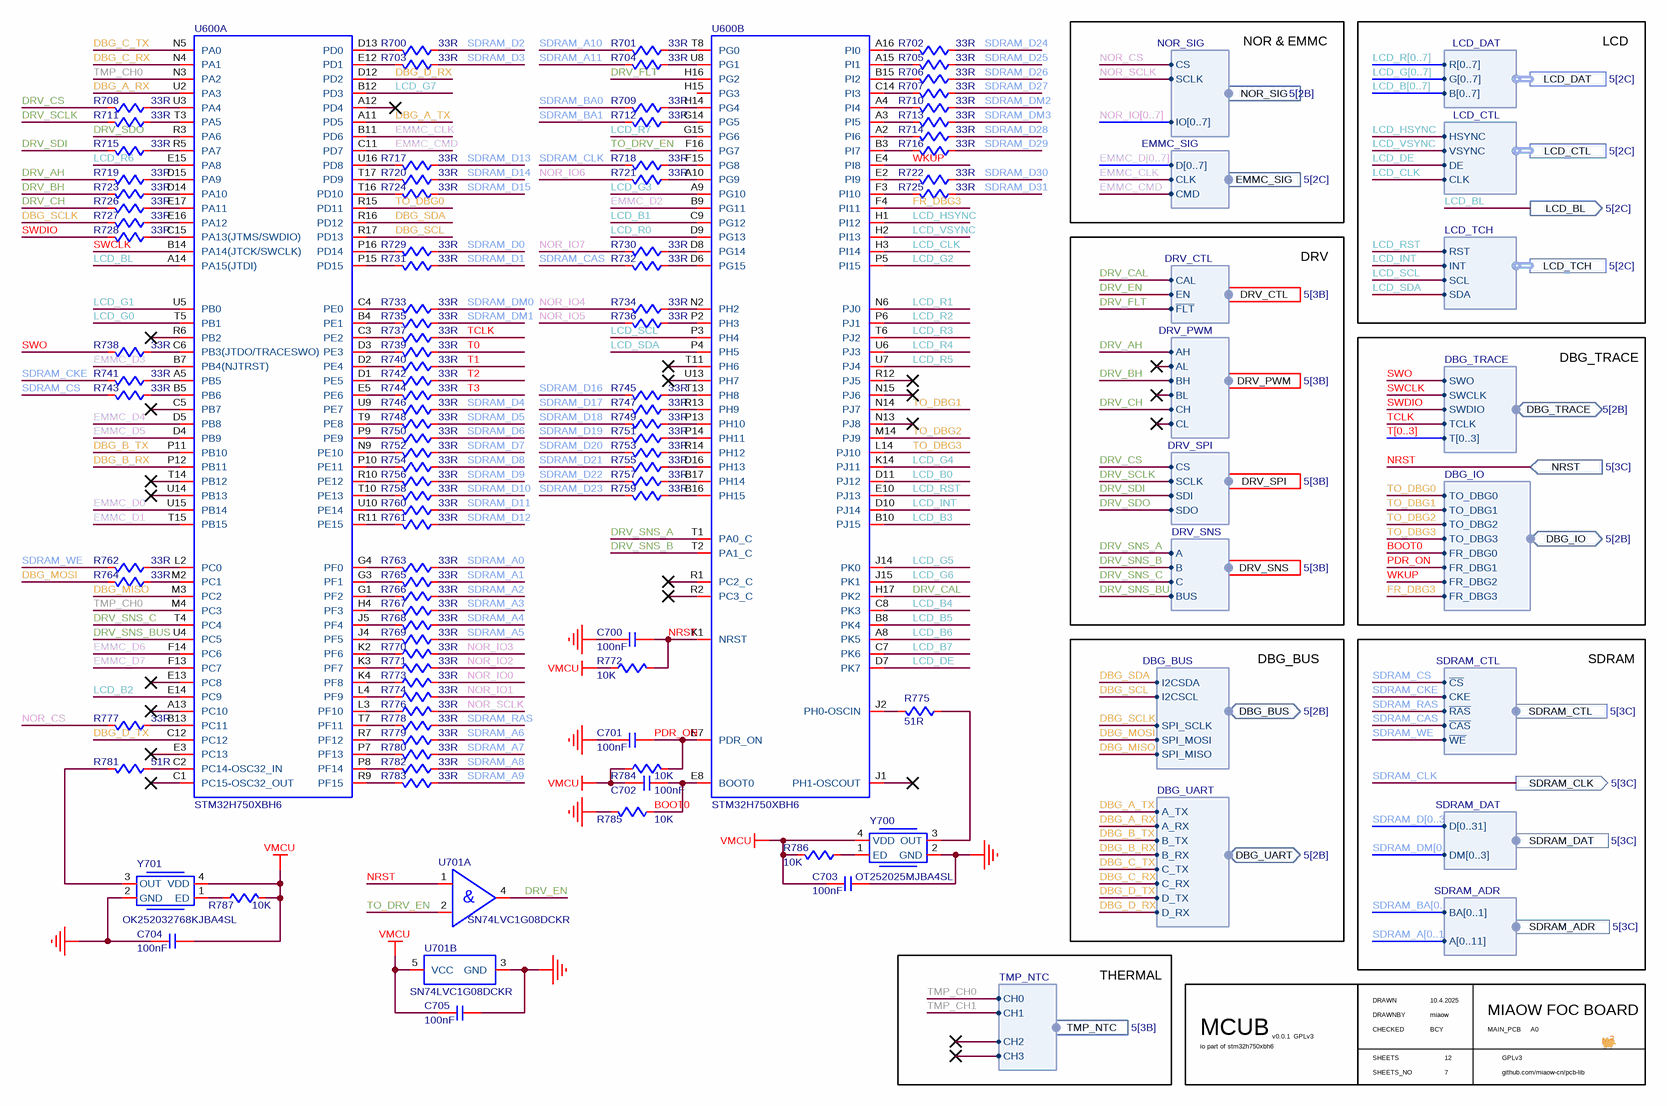
[diagram p6: stm32h750xbh6-sig.SchDoc]

### Parts
C700  value 100nF  [C0402]  (hidden comment: C-NOMO)
C701  value 100nF  [C0402]  (hidden comment: C-NOMO)
C702  value 100nF  [C0402]  (hidden comment: C-NOMO)
C703  value 100nF  [C0402]  (hidden comment: C-NOMO)
C704  value 100nF  [C0402]  (hidden comment: C-NOMO)
C705  value 100nF  [C0402]  (hidden comment: C-NOMO)
R700  value 33R  [R0402]  (hidden comment: R)
R701  value 33R  [R0402]  (hidden comment: R)
R702  value 33R  [R0402]  (hidden comment: R)
R703  value 33R  [R0402]  (hidden comment: R)
R704  value 33R  [R0402]  (hidden comment: R)
R705  value 33R  [R0402]  (hidden comment: R)
R706  value 33R  [R0402]  (hidden comment: R)
R707  value 33R  [R0402]  (hidden comment: R)
R708  value 33R  [R0402]  (hidden comment: R)
R709  value 33R  [R0402]  (hidden comment: R)
R710  value 33R  [R0402]  (hidden comment: R)
R711  value 33R  [R0402]  (hidden comment: R)
R712  value 33R  [R0402]  (hidden comment: R)
R713  value 33R  [R0402]  (hidden comment: R)
R714  value 33R  [R0402]  (hidden comment: R)
R715  value 33R  [R0402]  (hidden comment: R)
R716  value 33R  [R0402]  (hidden comment: R)
R717  value 33R  [R0402]  (hidden comment: R)
R718  value 33R  [R0402]  (hidden comment: R)
R719  value 33R  [R0402]  (hidden comment: R)
R720  value 33R  [R0402]  (hidden comment: R)
R721  value 33R  [R0402]  (hidden comment: R)
R722  value 33R  [R0402]  (hidden comment: R)
R723  value 33R  [R0402]  (hidden comment: R)
R724  value 33R  [R0402]  (hidden comment: R)
R725  value 33R  [R0402]  (hidden comment: R)
R726  value 33R  [R0402]  (hidden comment: R)
R727  value 33R  [R0402]  (hidden comment: R)
R728  value 33R  [R0402]  (hidden comment: R)
R729  value 33R  [R0402]  (hidden comment: R)
R730  value 33R  [R0402]  (hidden comment: R)
R731  value 33R  [R0402]  (hidden comment: R)
R732  value 33R  [R0402]  (hidden comment: R)
R733  value 33R  [R0402]  (hidden comment: R)
R734  value 33R  [R0402]  (hidden comment: R)
R735  value 33R  [R0402]  (hidden comment: R)
R736  value 33R  [R0402]  (hidden comment: R)
R737  value 33R  [R0402]  (hidden comment: R)
R738  value 33R  [R0402]  (hidden comment: R)
R739  value 33R  [R0402]  (hidden comment: R)
R740  value 33R  [R0402]  (hidden comment: R)
R741  value 33R  [R0402]  (hidden comment: R)
R742  value 33R  [R0402]  (hidden comment: R)
R743  value 33R  [R0402]  (hidden comment: R)
R744  value 33R  [R0402]  (hidden comment: R)
R745  value 33R  [R0402]  (hidden comment: R)
R746  value 33R  [R0402]  (hidden comment: R)
R747  value 33R  [R0402]  (hidden comment: R)
R748  value 33R  [R0402]  (hidden comment: R)
R749  value 33R  [R0402]  (hidden comment: R)
R750  value 33R  [R0402]  (hidden comment: R)
R751  value 33R  [R0402]  (hidden comment: R)
R752  value 33R  [R0402]  (hidden comment: R)
R753  value 33R  [R0402]  (hidden comment: R)
R754  value 33R  [R0402]  (hidden comment: R)
R755  value 33R  [R0402]  (hidden comment: R)
R756  value 33R  [R0402]  (hidden comment: R)
R757  value 33R  [R0402]  (hidden comment: R)
R758  value 33R  [R0402]  (hidden comment: R)
R759  value 33R  [R0402]  (hidden comment: R)
R760  value 33R  [R0402]  (hidden comment: R)
R761  value 33R  [R0402]  (hidden comment: R)
R762  value 33R  [R0402]  (hidden comment: R)
R763  value 33R  [R0402]  (hidden comment: R)
R764  value 33R  [R0402]  (hidden comment: R)
R765  value 33R  [R0402]  (hidden comment: R)
R766  value 33R  [R0402]  (hidden comment: R)
R767  value 33R  [R0402]  (hidden comment: R)
R768  value 33R  [R0402]  (hidden comment: R)
R769  value 33R  [R0402]  (hidden comment: R)
R770  value 33R  [R0402]  (hidden comment: R)
R771  value 33R  [R0402]  (hidden comment: R)
R772  value 10K  [R0402]  (hidden comment: R)
R773  value 33R  [R0402]  (hidden comment: R)
R774  value 33R  [R0402]  (hidden comment: R)
R775  value 51R  [R0402]  (hidden comment: R)
R776  value 33R  [R0402]  (hidden comment: R)
R777  value 33R  [R0402]  (hidden comment: R)
R778  value 33R  [R0402]  (hidden comment: R)
R779  value 33R  [R0402]  (hidden comment: R)
R780  value 33R  [R0402]  (hidden comment: R)
R781  value 51R  [R0402]  (hidden comment: R)
R782  value 33R  [R0402]  (hidden comment: R)
R783  value 33R  [R0402]  (hidden comment: R)
R784  value 10K  [R0402]  (hidden comment: R)
R785  value 10K  [R0402]  (hidden comment: R)
R786  value 10K  [R0402]  (hidden comment: R)
R787  value 10K  [R0402]  (hidden comment: R)
U600  STM32H750XBH6  [STM32H750XBH6]  (parts A,B of 3)
U701  SN74LVC1G08DCKR  [SN74LVC1G08DCKR]  (parts A,B of 2)
Y700  OT252025MJBA4SL  [OT252025MJBA4SL]
Y701  OK252032768KJBA4SL  [OK252032768KJBA4SL]

### Ports
DBG_BUS (bidir, harness DBG_BUS, see 5[2B]), DBG_IO (bidir, harness DBG_IO, see 5[2B]), DBG_TRACE (bidir, harness DBG_TRACE, see 5[2B]), DBG_UART (bidir, harness DBG_UART, see 5[2B]), DRV_CTL (out, harness DRV_CTL, see 5[3B]), DRV_PWM (out, harness DRV_PWM, see 5[3B]), DRV_SNS (out, harness DRV_SNS, see 5[3B]), DRV_SPI (out, harness DRV_SPI, see 5[3B]), EMMC_SIG (in, harness EMMC_SIG, see 5[2C]), LCD_BL (out, see 5[2C]), LCD_CTL (harness LCD_CTL, see 5[2C]), LCD_DAT (harness LCD_DAT, see 5[2C]), LCD_TCH (harness LCD_TCH, see 5[2C]), NOR_SIG (in, harness NOR_SIG, see 5[2B]), NRST (in, see 5[3C]), SDRAM_ADR (harness SDRAM_ADR, see 5[3C]), SDRAM_CLK (out, see 5[3C]), SDRAM_CTL (harness SDRAM_CTL, see 5[3C]), SDRAM_DAT (harness SDRAM_DAT, see 5[3C]), TMP_NTC (in, harness TMP_NTC, see 5[3B])

### Harnesses
SDRAM_DAT: DM[0..3], D[0..31]
SDRAM_ADR: BA[0..1], A[0..11]
SDRAM_CTL: ~{CS}, CKE, ~{RAS}, ~{CAS}, ~{WE}
DRV_CTL: CAL, EN, ~{FLT}
DRV_SNS: C, B, A, BUS
DRV_SPI: CS, SCLK, SDI, SDO
DRV_PWM: AH, AL, BH, BL, CH, CL
LCD_DAT: R[0..7], G[0..7], B[0..7]
LCD_CTL: HSYNC, VSYNC, DE, CLK
LCD_TCH: SDA, SCL, INT, RST
EMMC_SIG: D[0..7], CLK, CMD
NOR_SIG: CS, SCLK, IO[0..7]
DBG_UART: A_TX, A_RX, B_TX, B_RX, C_TX, C_RX, D_TX, D_RX
DBG_BUS: I2CSDA, I2CSCL, SPI_MISO, SPI_MOSI, SPI_SCLK
DBG_TRACE: SWO, SWCLK, SWDIO, TCLK, T[0..3]
DBG_IO: TO_DBG0, TO_DBG1, FR_DBG0, TO_DBG3, TO_DBG2, FR_DBG1, FR_DBG2, FR_DBG3
TMP_NTC: CH0, CH1, CH2, CH3

### Nets
GND: C700.2 C701.2 C703.2 C704.2 C705.2 R785.1 U701.3(GND) Y700.2(GND) Y701.2(GND)  [project net GMCUA]
VMCU: C702.2 C703.1 C704.1 C705.1 R772.1 R784.2 R786.1 R787.1 U701.5(VCC) Y700.4(VDD) Y701.4(VDD)  [project net +3V3]
BOOT0: C702.1 R785.2 U600.E8(BOOT0) ; port DBG_IO.FR_DBG0
DBG_A_RX: U600.U2(PA3) ; port DBG_UART.A_RX
DBG_A_TX: U600.A11(PD5) ; port DBG_UART.A_TX
DBG_B_RX: U600.P12(PB11) ; port DBG_UART.B_RX
DBG_B_TX: U600.P11(PB10) ; port DBG_UART.B_TX
DBG_C_RX: U600.N4(PA1) ; port DBG_UART.C_RX
DBG_C_TX: U600.N5(PA0) ; port DBG_UART.C_TX
DBG_D_RX: U600.D12(PD2) ; port DBG_UART.D_RX
DBG_D_TX: U600.C12(PC12) ; port DBG_UART.D_TX
DBG_MISO: U600.M3(PC2) ; port DBG_BUS.SPI_MISO
DBG_MOSI: R764.2 ; port DBG_BUS.SPI_MOSI
DBG_SCL: U600.R17(PD13) ; port DBG_BUS.I2CSCL
DBG_SCLK: R727.2 ; port DBG_BUS.SPI_SCLK
DBG_SDA: U600.R16(PD12) ; port DBG_BUS.I2CSDA
DRV_AH: R719.2 ; port DRV_PWM.AH
DRV_BH: R723.2 ; port DRV_PWM.BH
DRV_CAL: U600.H17(PK2) ; port DRV_CTL.CAL
DRV_CH: R726.2 ; port DRV_PWM.CH
DRV_CS: R708.2 ; port DRV_SPI.CS
DRV_EN: U701.4(Y) ; port DRV_CTL.EN
DRV_FLT: U600.H16(PG2) ; port DRV_CTL.~{FLT}
DRV_SCLK: R711.2 ; port DRV_SPI.SCLK
DRV_SDI: R715.2 ; port DRV_SPI.SDI
DRV_SDO: U600.R3(PA6) ; port DRV_SPI.SDO
DRV_SNS_A: U600.T1(PA0_C) ; port DRV_SNS.A
DRV_SNS_B: U600.T2(PA1_C) ; port DRV_SNS.B
DRV_SNS_BUS: U600.U4(PC5) ; port DRV_SNS.BUS
DRV_SNS_C: U600.T4(PC4) ; port DRV_SNS.C
EMMC_CLK: U600.B11(PD6) ; port EMMC_SIG.CLK
EMMC_CMD: U600.C11(PD7) ; port EMMC_SIG.CMD  [project net CMD]
EMMC_D0: U600.U15(PB14)
EMMC_D1: U600.T15(PB15)
EMMC_D2: U600.B9(PG11)
EMMC_D3: U600.B7(PB4(NJTRST))
EMMC_D4: U600.D5(PB8)
EMMC_D5: U600.D4(PB9)
EMMC_D6: U600.F14(PC6)
EMMC_D7: U600.F13(PC7)
FR_DBG3: U600.F4(PI11) ; port DBG_IO.FR_DBG3
LCD_B0: U600.D11(PJ12)  [project net B0]
LCD_B1: U600.C9(PG12)  [project net B1]
LCD_B2: U600.E14(PC9)  [project net B2]
LCD_B3: U600.B10(PJ15)  [project net B3]
LCD_B4: U600.C8(PK3)  [project net B4]
LCD_B5: U600.B8(PK4)  [project net B5]
LCD_B6: U600.A8(PK5)  [project net B6]
LCD_B7: U600.C7(PK6)  [project net B7]
LCD_BL: U600.A14(PA15(JTDI)) ; port LCD_BL  [project net BL]
LCD_CLK: U600.H3(PI14) ; port LCD_CTL.CLK  [project net CLK]
LCD_DE: U600.D7(PK7) ; port LCD_CTL.DE  [project net DE]
LCD_G0: U600.T5(PB1)  [project net G0]
LCD_G1: U600.U5(PB0)  [project net G1]
LCD_G2: U600.P5(PI15)  [project net G2]
LCD_G3: U600.A9(PG10)  [project net G3]
LCD_G4: U600.K14(PJ11)  [project net G4]
LCD_G5: U600.J14(PK0)  [project net G5]
LCD_G6: U600.J15(PK1)  [project net G6]
LCD_G7: U600.B12(PD3)  [project net G7]
LCD_HSYNC: U600.H1(PI12) ; port LCD_CTL.HSYNC  [project net HSYNC]
LCD_INT: U600.D10(PJ14) ; port LCD_TCH.INT
LCD_R0: U600.D9(PG13)
LCD_R1: U600.N6(PJ0)
LCD_R2: U600.P6(PJ1)
LCD_R3: U600.T6(PJ2)
LCD_R4: U600.U6(PJ3)
LCD_R5: U600.U7(PJ4)
LCD_R6: U600.E15(PA8)
LCD_R7: U600.G15(PG6)
LCD_RST: U600.E10(PJ13) ; port LCD_TCH.RST
LCD_SCL: U600.P3(PH4) ; port LCD_TCH.SCL
LCD_SDA: U600.P4(PH5) ; port LCD_TCH.SDA
LCD_VSYNC: U600.H2(PI13) ; port LCD_CTL.VSYNC
NOR_CS: R777.2 ; port NOR_SIG.CS
NOR_IO0: R773.2
NOR_IO1: R774.2
NOR_IO2: R771.2
NOR_IO3: R770.2
NOR_IO4: R734.2
NOR_IO5: R736.2
NOR_IO6: R721.2
NOR_IO7: R730.2
NOR_SCLK: R776.2 ; port NOR_SIG.SCLK
NRST: C700.1 R772.2 U600.K1(NRST) U701.1(A) ; port NRST
PDR_ON: C701.1 R784.1 U600.E7(PDR_ON) ; port DBG_IO.FR_DBG1  [project net FR_DBG1]
SDRAM_A0: R763.2  [project net A0]
SDRAM_A1: R765.2  [project net A1]
SDRAM_A2: R766.2  [project net A2]
SDRAM_A3: R767.2  [project net A3]
SDRAM_A4: R768.2  [project net A4]
SDRAM_A5: R769.2  [project net A5]
SDRAM_A6: R779.2  [project net A6]
SDRAM_A7: R780.2  [project net A7]
SDRAM_A8: R782.2  [project net A8]
SDRAM_A9: R783.2  [project net A9]
SDRAM_A10: R701.2  [project net A10]
SDRAM_A11: R704.2  [project net A11]
SDRAM_BA0: R709.2  [project net BA0]
SDRAM_BA1: R712.2  [project net BA1]
SDRAM_CAS: R732.2 ; port SDRAM_CTL.~{CAS}
SDRAM_CKE: R741.2 ; port SDRAM_CTL.CKE
SDRAM_CLK: R718.2 ; port SDRAM_CLK
SDRAM_CS: R743.2 ; port SDRAM_CTL.~{CS}
SDRAM_D0: R729.2  [project net D0]
SDRAM_D1: R731.2  [project net D1]
SDRAM_D2: R700.2  [project net D2]
SDRAM_D3: R703.2  [project net D3]
SDRAM_D4: R746.2  [project net D4]
SDRAM_D5: R748.2  [project net D5]
SDRAM_D6: R750.2  [project net D6]
SDRAM_D7: R752.2  [project net D7]
SDRAM_D8: R754.2  [project net D8]
SDRAM_D9: R756.2  [project net D9]
SDRAM_D10: R758.2  [project net D10]
SDRAM_D11: R760.2  [project net D11]
SDRAM_D12: R761.2  [project net D12]
SDRAM_D13: R717.2  [project net D13]
SDRAM_D14: R720.2  [project net D14]
SDRAM_D15: R724.2  [project net D15]
SDRAM_D16: R745.2  [project net D16]
SDRAM_D17: R747.2  [project net D17]
SDRAM_D18: R749.2  [project net D18]
SDRAM_D19: R751.2  [project net D19]
SDRAM_D20: R753.2  [project net D20]
SDRAM_D21: R755.2  [project net D21]
SDRAM_D22: R757.2  [project net D22]
SDRAM_D23: R759.2  [project net D23]
SDRAM_D24: R702.2  [project net D24]
SDRAM_D25: R705.2  [project net D25]
SDRAM_D26: R706.2  [project net D26]
SDRAM_D27: R707.2  [project net D27]
SDRAM_D28: R714.2  [project net D28]
SDRAM_D29: R716.2  [project net D29]
SDRAM_D30: R722.2  [project net D30]
SDRAM_D31: R725.2  [project net D31]
SDRAM_DM0: R733.2  [project net DM0]
SDRAM_DM1: R735.2  [project net DM1]
SDRAM_DM2: R710.2  [project net DM2]
SDRAM_DM3: R713.2  [project net DM3]
SDRAM_RAS: R778.2 ; port SDRAM_CTL.~{RAS}
SDRAM_WE: R762.2 ; port SDRAM_CTL.~{WE}
SWCLK: U600.B14(PA14(JTCK/SWCLK)) ; port DBG_TRACE.SWCLK
SWDIO: R728.2 ; port DBG_TRACE.SWDIO
SWO: R738.2 ; port DBG_TRACE.SWO
T0: R739.2
T1: R740.2
T2: R742.2
T3: R744.2
TCLK: R737.2 ; port DBG_TRACE.TCLK
TMP_CH0: U600.M4(PC3) U600.N3(PA2) ; port TMP_NTC.CH0
TO_DBG0: U600.R15(PD11) ; port DBG_IO.TO_DBG0
TO_DBG1: U600.N14(PJ7) ; port DBG_IO.TO_DBG1
TO_DBG2: U600.M14(PJ9) ; port DBG_IO.TO_DBG2
TO_DBG3: U600.L14(PJ10) ; port DBG_IO.TO_DBG3
TO_DRV_EN: U600.F16(PG7) U701.2(B)
WKUP: U600.E4(PI8) ; port DBG_IO.FR_DBG2  [project net FR_DBG2]
NetR700_1: R700.1 U600.D13(PD0)
NetR701_1: R701.1 U600.T8(PG0)
NetR702_1: R702.1 U600.A16(PI0)
NetR703_1: R703.1 U600.E12(PD1)
NetR704_1: R704.1 U600.U8(PG1)
NetR705_1: R705.1 U600.A15(PI1)
NetR706_1: R706.1 U600.B15(PI2)
NetR707_1: R707.1 U600.C14(PI3)
NetR708_1: R708.1 U600.U3(PA4)
NetR709_1: R709.1 U600.H14(PG4)
NetR710_1: R710.1 U600.A4(PI4)
NetR711_1: R711.1 U600.T3(PA5)
NetR712_1: R712.1 U600.G14(PG5)
NetR713_1: R713.1 U600.A3(PI5)
NetR714_1: R714.1 U600.A2(PI6)
NetR715_1: R715.1 U600.R5(PA7)
NetR716_1: R716.1 U600.B3(PI7)
NetR717_1: R717.1 U600.U16(PD8)
NetR718_1: R718.1 U600.F15(PG8)
NetR719_1: R719.1 U600.D15(PA9)
NetR720_1: R720.1 U600.T17(PD9)
NetR721_1: R721.1 U600.A10(PG9)
NetR722_1: R722.1 U600.E2(PI9)
NetR723_1: R723.1 U600.D14(PA10)
NetR724_1: R724.1 U600.T16(PD10)
NetR725_1: R725.1 U600.F3(PI10)
NetR726_1: R726.1 U600.E17(PA11)
NetR727_1: R727.1 U600.E16(PA12)
NetR728_1: R728.1 U600.C15(PA13(JTMS/SWDIO))
NetR729_1: R729.1 U600.P16(PD14)
NetR730_1: R730.1 U600.D8(PG14)
NetR731_1: R731.1 U600.P15(PD15)
NetR732_1: R732.1 U600.D6(PG15)
NetR733_1: R733.1 U600.C4(PE0)
NetR734_1: R734.1 U600.N2(PH2)
NetR735_1: R735.1 U600.B4(PE1)
NetR736_1: R736.1 U600.P2(PH3)
NetR737_1: R737.1 U600.C3(PE2)
NetR738_1: R738.1 U600.C6(PB3(JTDO/TRACESWO))
NetR739_1: R739.1 U600.D3(PE3)
NetR740_1: R740.1 U600.D2(PE4)
NetR741_1: R741.1 U600.A5(PB5)
NetR742_1: R742.1 U600.D1(PE5)
NetR743_1: R743.1 U600.B5(PB6)
NetR744_1: R744.1 U600.E5(PE6)
NetR745_1: R745.1 U600.T13(PH8)
NetR746_1: R746.1 U600.U9(PE7)
NetR747_1: R747.1 U600.R13(PH9)
NetR748_1: R748.1 U600.T9(PE8)
NetR749_1: R749.1 U600.P13(PH10)
NetR750_1: R750.1 U600.P9(PE9)
NetR751_1: R751.1 U600.P14(PH11)
NetR752_1: R752.1 U600.N9(PE10)
NetR753_1: R753.1 U600.R14(PH12)
NetR754_1: R754.1 U600.P10(PE11)
NetR755_1: R755.1 U600.D16(PH13)
NetR756_1: R756.1 U600.R10(PE12)
NetR757_1: R757.1 U600.B17(PH14)
NetR758_1: R758.1 U600.T10(PE13)
NetR759_1: R759.1 U600.B16(PH15)
NetR760_1: R760.1 U600.U10(PE14)
NetR761_1: R761.1 U600.R11(PE15)
NetR762_1: R762.1 U600.L2(PC0)
NetR763_1: R763.1 U600.G4(PF0)
NetR764_1: R764.1 U600.M2(PC1)
NetR765_1: R765.1 U600.G3(PF1)
NetR766_1: R766.1 U600.G1(PF2)
NetR767_1: R767.1 U600.H4(PF3)
NetR768_1: R768.1 U600.J5(PF4)
NetR769_1: R769.1 U600.J4(PF5)
NetR770_1: R770.1 U600.K2(PF6)
NetR771_1: R771.1 U600.K3(PF7)
NetR773_1: R773.1 U600.K4(PF8)
NetR774_1: R774.1 U600.L4(PF9)
NetR775_1: R775.1 U600.J2(PH0-OSCIN)
NetR775_2: R775.2 Y700.3(OUT)
NetR776_1: R776.1 U600.L3(PF10)
NetR777_1: R777.1 U600.B13(PC11)
NetR778_1: R778.1 U600.T7(PF11)
NetR779_1: R779.1 U600.R7(PF12)
NetR780_1: R780.1 U600.P7(PF13)
NetR781_1: R781.1 Y701.3(OUT)
NetR781_2: R781.2 U600.C2(PC14-OSC32_IN)
NetR782_1: R782.1 U600.P8(PF14)
NetR783_1: R783.1 U600.R9(PF15)
NetR786_2: R786.2 Y700.1(ED)
NetR787_2: R787.2 Y701.1(ED)

Not connected (* = marked no-connect by the designer): U600 A12(PD4)* A13(PC10)* C1(PC15-OSC32_OUT)* C5(PB7)* E3(PC13)* E13(PC8)* H15(PG3) J1(PH1-OSCOUT)* N13(PJ8)* N15(PJ6)* R1(PC2_C)* R2(PC3_C)* R6(PB2)* R12(PJ5)* T11(PH6)* T14(PB12)* U13(PH7)* U14(PB13)*

### Buses and harness runs
bus EMMC_D[0..7]
bus LCD_B[0..7]
bus LCD_G[0..7]
bus LCD_R[0..7]
bus NOR_IO[0..7]
bus SDRAM_A[0..11]
bus SDRAM_BA[0..1]
bus SDRAM_D[0..31]
bus SDRAM_DM[0..3]
bus T[0..3]

### Notes on the sheet
- NOR & EMMC
- LCD
- DRV
- DBG_TRACE
- DBG_BUS
- SDRAM
- THERMAL
- DRAWN
- CHECKED
- DRAWNBY
- SHEETS
- SHEETS_NO
- (in symbol SN74LVC1G08DCKR, part A) &

### Library data of the parts
C700-C705 = C-NOMO: voltage: 25V; precision: 5%
R700-R787 = R: precision: 1%
U600 = STM32H750XBH6: MCU; Supplier 1: LCSC; Supplier Part Number 1: C405932
U701 = SN74LVC1G08DCKR: AND GATE  - 1bit; Supplier 1: LCSC; Supplier Part Number 1: C7832
Y700 = OT252025MJBA4SL: value: 25MHz; Supplier 1: LCSC; Supplier Part Number 1: C717683
Y701 = OK252032768KJBA4SL: value: 32.768KHz; Supplier 1: LCSC; Supplier Part Number 1: C669098

## Sheet lcd.SchDoc: LCD
size A4; Date: 10.06.2025; CheckedBy: BCY; DrawnBy: miaow; DocumentNumber: 8; Revision: v0.0.1; SheetNumber: 8; SheetTotal: 12; Sample: A0; Url: github.com/miaow-cn/pcb-lib; Liscense: GPLv3; Board: MIAOW FOC BOARD; BoardType: MAIN_PCB; Desc: fpc socket for rgb888 lcd & touch interface
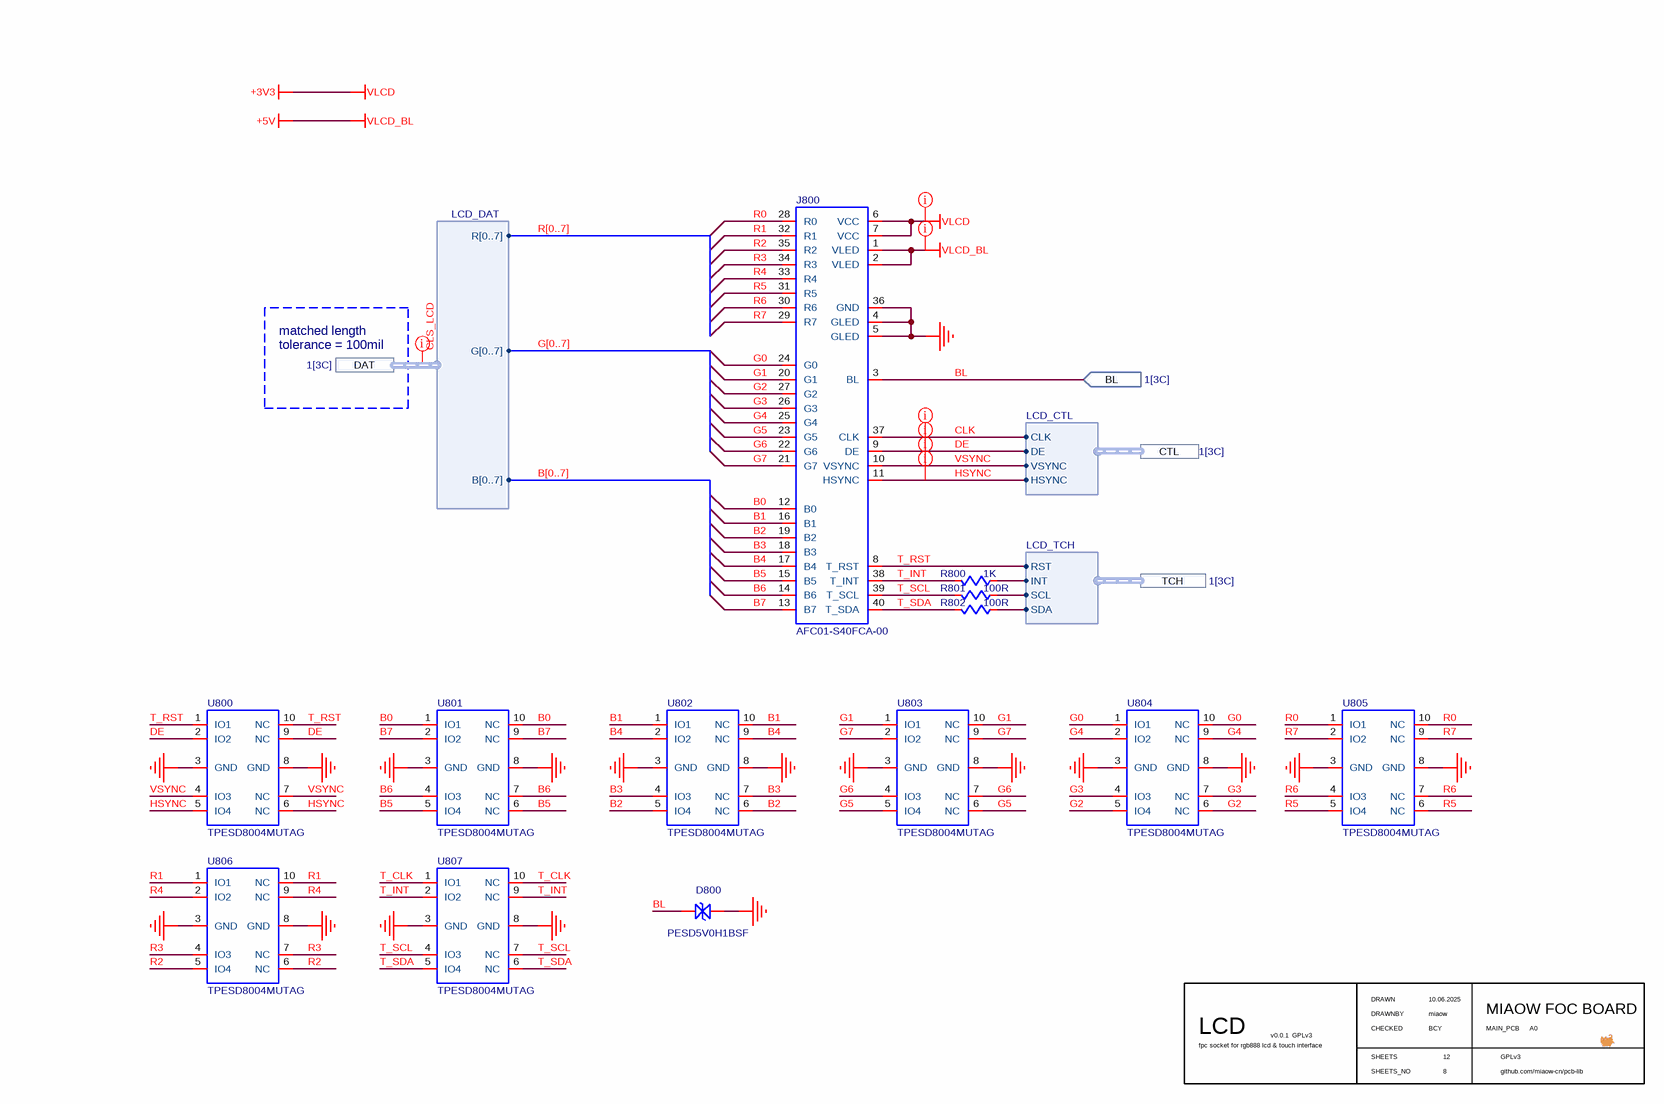
[diagram p7: lcd.SchDoc]

### Parts
D800  PESD5V0H1BSF  [PESD5V0H1BSF]
J800  AFC01-S40FCA-00  [AFC01-S40FCA-00]
R800  value 1K  [R0402]  (hidden comment: R)
R801  value 100R  [R0402]  (hidden comment: R)
R802  value 100R  [R0402]  (hidden comment: R)
U800  TPESD8004MUTAG  [TPESD8004MUTAG]
U801  TPESD8004MUTAG  [TPESD8004MUTAG]
U802  TPESD8004MUTAG  [TPESD8004MUTAG]
U803  TPESD8004MUTAG  [TPESD8004MUTAG]
U804  TPESD8004MUTAG  [TPESD8004MUTAG]
U805  TPESD8004MUTAG  [TPESD8004MUTAG]
U806  TPESD8004MUTAG  [TPESD8004MUTAG]
U807  TPESD8004MUTAG  [TPESD8004MUTAG]

### Ports
BL (in, see 1[3C]), CTL (harness LCD_CTL, see 1[3C]), DAT (harness LCD_DAT, see 1[3C]), TCH (harness LCD_TCH, see 1[3C])

### Harnesses
LCD_DAT: R[0..7], G[0..7], B[0..7]
LCD_CTL: HSYNC, VSYNC, DE, CLK
LCD_TCH: SDA, SCL, INT, RST

### Nets
+3V3: J800.6(VCC) J800.7(VCC)  [also labelled VLCD]
+5V: J800.1(VLED) J800.2(VLED)  [also labelled VLCD_BL]
GND: D800.2 J800.4(GLED) J800.5(GLED) J800.36(GND) U800.3(GND) U800.8(GND) U801.3(GND) U801.8(GND) U802.3(GND) U802.8(GND) U803.3(GND) U803.8(GND) U804.3(GND) U804.8(GND) U805.3(GND) U805.8(GND) U806.3(GND) U806.8(GND) U807.3(GND) U807.8(GND)  [project net GMCUA]
B0: J800.12(B0) U801.1(IO1) U801.10(NC)
B1: J800.16(B1) U802.1(IO1) U802.10(NC)
B2: J800.19(B2) U802.5(IO4) U802.6(NC)
B3: J800.18(B3) U802.4(IO3) U802.7(NC)
B4: J800.17(B4) U802.2(IO2) U802.9(NC)
B5: J800.15(B5) U801.5(IO4) U801.6(NC)
B6: J800.14(B6) U801.4(IO3) U801.7(NC)
B7: J800.13(B7) U801.2(IO2) U801.9(NC)
BL: D800.1 J800.3(BL) ; port BL
CLK: J800.37(CLK) ; port CTL.CLK
DE: J800.9(DE) U800.2(IO2) U800.9(NC) ; port CTL.DE
G0: J800.24(G0) U804.1(IO1) U804.10(NC)
G1: J800.20(G1) U803.1(IO1) U803.10(NC)
G2: J800.27(G2) U804.5(IO4) U804.6(NC)
G3: J800.26(G3) U804.4(IO3) U804.7(NC)
G4: J800.25(G4) U804.2(IO2) U804.9(NC)
G5: J800.23(G5) U803.5(IO4) U803.6(NC)
G6: J800.22(G6) U803.4(IO3) U803.7(NC)
G7: J800.21(G7) U803.2(IO2) U803.9(NC)
HSYNC: J800.11(HSYNC) U800.5(IO4) U800.6(NC) ; port CTL.HSYNC
LCD_INT: R800.2 ; port TCH.INT
LCD_SCL: R801.2 ; port TCH.SCL
LCD_SDA: R802.2 ; port TCH.SDA
R0: J800.28(R0) U805.1(IO1) U805.10(NC)  [project net LCD_R0]
R1: J800.32(R1) U806.1(IO1) U806.10(NC)  [project net LCD_R1]
R2: J800.35(R2) U806.5(IO4) U806.6(NC)  [project net LCD_R2]
R3: J800.34(R3) U806.4(IO3) U806.7(NC)  [project net LCD_R3]
R4: J800.33(R4) U806.2(IO2) U806.9(NC)  [project net LCD_R4]
R5: J800.31(R5) U805.5(IO4) U805.6(NC)  [project net LCD_R5]
R6: J800.30(R6) U805.4(IO3) U805.7(NC)  [project net LCD_R6]
R7: J800.29(R7) U805.2(IO2) U805.9(NC)  [project net LCD_R7]
T_CLK: U807.1(IO1) U807.10(NC)
T_INT: J800.38(T_INT) R800.1 U807.2(IO2) U807.9(NC)
T_RST: J800.8(T_RST) U800.1(IO1) U800.10(NC) ; port TCH.RST  [project net LCD_RST]
T_SCL: J800.39(T_SCL) R801.1 U807.4(IO3) U807.7(NC)
T_SDA: J800.40(T_SDA) R802.1 U807.5(IO4) U807.6(NC)
VSYNC: J800.10(VSYNC) U800.4(IO3) U800.7(NC) ; port CTL.VSYNC  [project net LCD_VSYNC]

### Buses and harness runs
bus B[0..7]
bus G[0..7]
bus R[0..7]

### Layout directives
net class CLS_EMMC: CLK, DE, HSYNC, LCD_VSYNC
net class CLS_LCD: (no net found under the mark)
net class CLS_PWR: +3V3, +5V

### Notes on the sheet
- matched length tolerance = 100mil
- DRAWN
- CHECKED
- DRAWNBY
- SHEETS
- SHEETS_NO

### Library data of the parts
D800 = PESD5V0H1BSF: TVS/ESD; Supplier 1: LCSC; Supplier Part Number 1: C477989
J800 = FPC-RGBLCD: Supplier 1: LCSC; Supplier Part Number 1: C262674
R800-R802 = R: precision: 1%
U800-U807 = TPESD8004MUTAG: TVS/ESD; Supplier 1: LCSC; Supplier Part Number 1: C2827679